# Altium project Fuel_Dispenser_Controller_V1.0.0.PrjPcb (part 1 of 2)
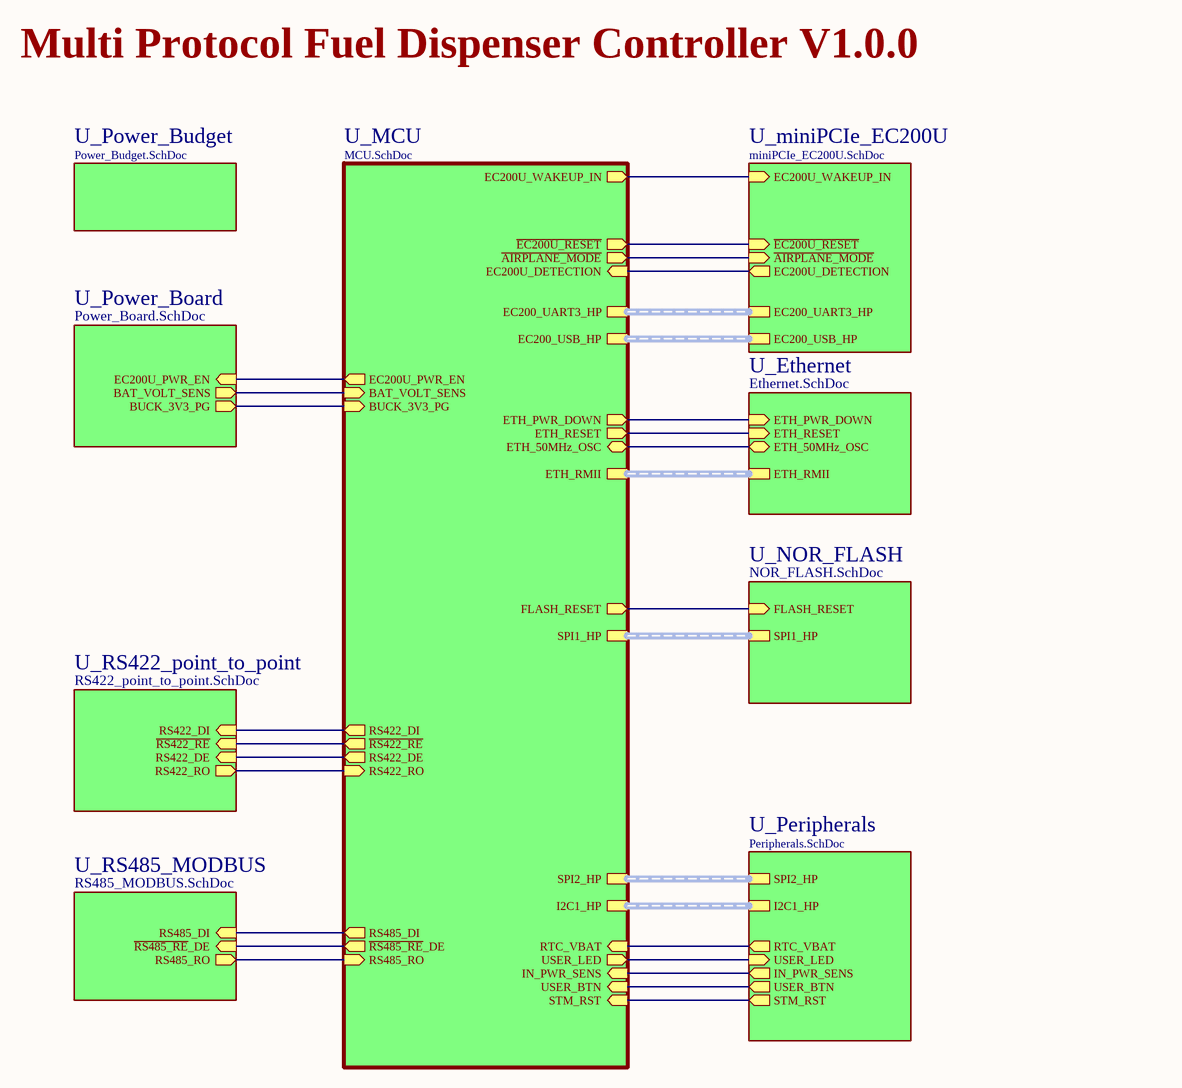
[diagram p0: Top_Sheet.SchDoc]
10 sheets, 253 parts. Net scope: hierarchical (ports join the sheet entries above them; power ports are global).
Board file: Fuel_Dispenser_Controller_V1.0.0.PcbDoc
Sheets:
  Top_Sheet.SchDoc
    U_MCU = MCU.SchDoc
    U_miniPCIe_EC200U = miniPCIe_EC200U.SchDoc
    U_Ethernet = Ethernet.SchDoc
    U_Power_Board = Power_Board.SchDoc
    U_RS485_MODBUS = RS485_MODBUS.SchDoc
    U_RS422_point_to_point = RS422_point_to_point.SchDoc
    U_NOR_FLASH = NOR_FLASH.SchDoc
    U_Peripherals = Peripherals.SchDoc
    U_Power_Budget = Power_Budget.SchDoc

## Sheet Top_Sheet.SchDoc
size A3; SheetNumber: 1; SheetTotal: 10

### Sub-sheets
U_Ethernet = Ethernet.SchDoc: ETH_RMII (harness ETH_RMII), ETH_50MHz_OSC (bidir), ETH_RESET (in), ETH_PWR_DOWN (in)
U_MCU = MCU.SchDoc: EC200U_WAKEUP_IN (out), ~{EC200U_RESET} (out), ~{AIRPLANE_MODE} (out), EC200U_DETECTION (in), SPI1_HP (harness SPI1), I2C1_HP (harness I2C1), EC200_USB_HP (harness EC200_USB), SPI2_HP (harness SPI2_uSD), EC200U_PWR_EN (out), STM_RST (in), RTC_VBAT (in), IN_PWR_SENS (in), USER_LED (out), USER_BTN (in), ETH_50MHz_OSC (bidir), ETH_RESET (out), EC200_UART3_HP (harness EC200_UART3), BAT_VOLT_SENS (in), ETH_RMII (harness ETH_RMII), RS485_RO (in), RS485_DI (out), ~{RS485_RE}_DE (out), RS422_RO (in), RS422_DI (out), ~{RS422_RE} (out), RS422_DE (out), BUCK_3V3_PG (in), FLASH_RESET (out), ETH_PWR_DOWN (out)
U_miniPCIe_EC200U = miniPCIe_EC200U.SchDoc: EC200_USB_HP (harness EC200_USB), EC200U_DETECTION (out), ~{AIRPLANE_MODE} (in), EC200_UART3_HP (harness EC200_UART3), ~{EC200U_RESET} (in), EC200U_WAKEUP_IN (in)
U_NOR_FLASH = NOR_FLASH.SchDoc: SPI1_HP (harness SPI1), FLASH_RESET (in)
U_Peripherals = Peripherals.SchDoc: I2C1_HP (harness I2C1), USER_LED (in), IN_PWR_SENS (out), USER_BTN (out), STM_RST (out), RTC_VBAT (out), SPI2_HP (harness SPI2_uSD)
U_Power_Board = Power_Board.SchDoc: BAT_VOLT_SENS (out), BUCK_3V3_PG (out), EC200U_PWR_EN (in)
U_Power_Budget = Power_Budget.SchDoc: no entries
U_RS422_point_to_point = RS422_point_to_point.SchDoc: RS422_DI (in), ~{RS422_RE} (in), RS422_DE (in), RS422_RO (out)
U_RS485_MODBUS = RS485_MODBUS.SchDoc: RS485_DI (in), ~{RS485_RE}_DE (in), RS485_RO (out)

### Nets
~{AIRPLANE_MODE}: sheet U_MCU/~{AIRPLANE_MODE}, sheet U_miniPCIe_EC200U/~{AIRPLANE_MODE}
BAT_VOLT_SENS: sheet U_MCU/BAT_VOLT_SENS, sheet U_Power_Board/BAT_VOLT_SENS
BUCK_3V3_PG: sheet U_MCU/BUCK_3V3_PG, sheet U_Power_Board/BUCK_3V3_PG
~{EC200U_RESET}: sheet U_MCU/~{EC200U_RESET}, sheet U_miniPCIe_EC200U/~{EC200U_RESET}
EC200U_DETECTION: sheet U_MCU/EC200U_DETECTION, sheet U_miniPCIe_EC200U/EC200U_DETECTION
EC200U_PWR_EN: sheet U_MCU/EC200U_PWR_EN, sheet U_Power_Board/EC200U_PWR_EN
EC200U_WAKEUP_IN: sheet U_MCU/EC200U_WAKEUP_IN, sheet U_miniPCIe_EC200U/EC200U_WAKEUP_IN
ETH_50MHz_OSC: sheet U_MCU/ETH_50MHz_OSC, sheet U_Ethernet/ETH_50MHz_OSC
ETH_PWR_DOWN: sheet U_MCU/ETH_PWR_DOWN, sheet U_Ethernet/ETH_PWR_DOWN
ETH_RESET: sheet U_MCU/ETH_RESET, sheet U_Ethernet/ETH_RESET
FLASH_RESET: sheet U_MCU/FLASH_RESET, sheet U_NOR_FLASH/FLASH_RESET
IN_PWR_SENS: sheet U_MCU/IN_PWR_SENS, sheet U_Peripherals/IN_PWR_SENS
~{RS485_RE}_DE: sheet U_MCU/~{RS485_RE}_DE, sheet U_RS485_MODBUS/~{RS485_RE}_DE
RS422_DE: sheet U_MCU/RS422_DE, sheet U_RS422_point_to_point/RS422_DE
RS422_DI: sheet U_MCU/RS422_DI, sheet U_RS422_point_to_point/RS422_DI
RS422_RE: sheet U_MCU/~{RS422_RE}, sheet U_RS422_point_to_point/~{RS422_RE}
RS422_RO: sheet U_MCU/RS422_RO, sheet U_RS422_point_to_point/RS422_RO
RS485_DI: sheet U_MCU/RS485_DI, sheet U_RS485_MODBUS/RS485_DI
RS485_RO: sheet U_MCU/RS485_RO, sheet U_RS485_MODBUS/RS485_RO
RTC_VBAT: sheet U_MCU/RTC_VBAT, sheet U_Peripherals/RTC_VBAT
STM_RST: sheet U_MCU/STM_RST, sheet U_Peripherals/STM_RST
USER_BTN: sheet U_MCU/USER_BTN, sheet U_Peripherals/USER_BTN
USER_LED: sheet U_MCU/USER_LED, sheet U_Peripherals/USER_LED

### Buses and harness runs
harness sheet U_Ethernet/ETH_RMII = sheet U_MCU/ETH_RMII
harness sheet U_MCU/EC200_UART3_HP = sheet U_miniPCIe_EC200U/EC200_UART3_HP
harness sheet U_MCU/EC200_USB_HP = sheet U_miniPCIe_EC200U/EC200_USB_HP
harness sheet U_MCU/I2C1_HP = sheet U_Peripherals/I2C1_HP
harness sheet U_MCU/SPI1_HP = sheet U_NOR_FLASH/SPI1_HP
harness sheet U_MCU/SPI2_HP = sheet U_Peripherals/SPI2_HP

### Notes on the sheet
- Multi Protocol Fuel Dispenser Controller V1.0.0

## Sheet MCU.SchDoc
size A2; SheetNumber: 2; SheetTotal: 10
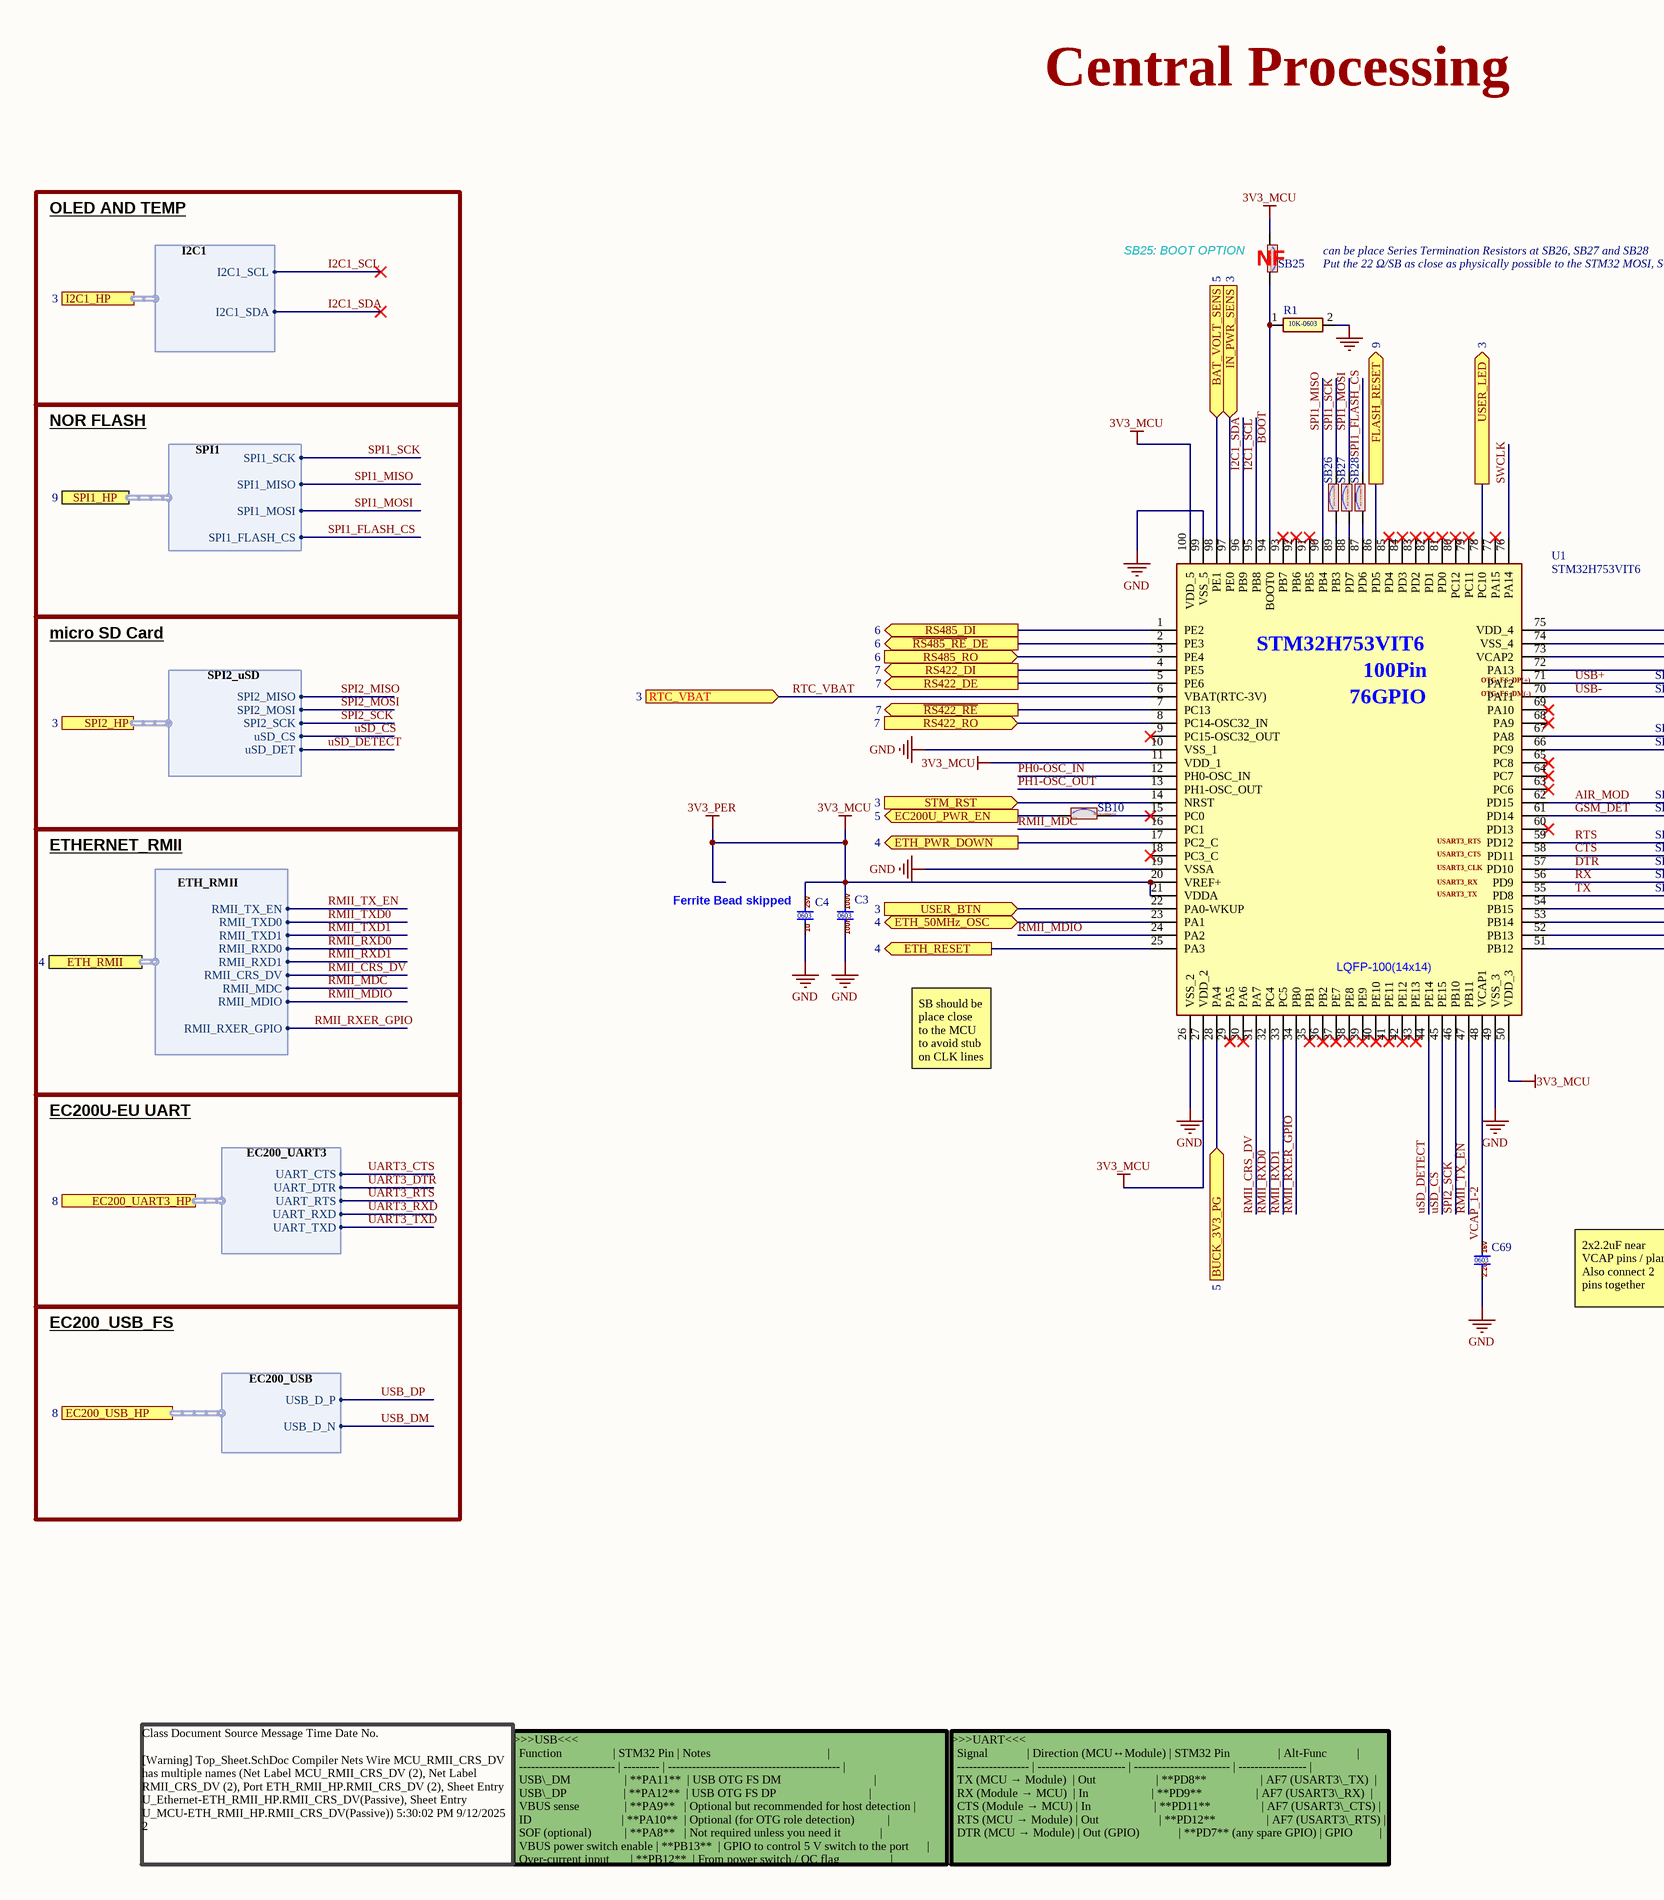
[diagram p1: MCU.SchDoc, left]
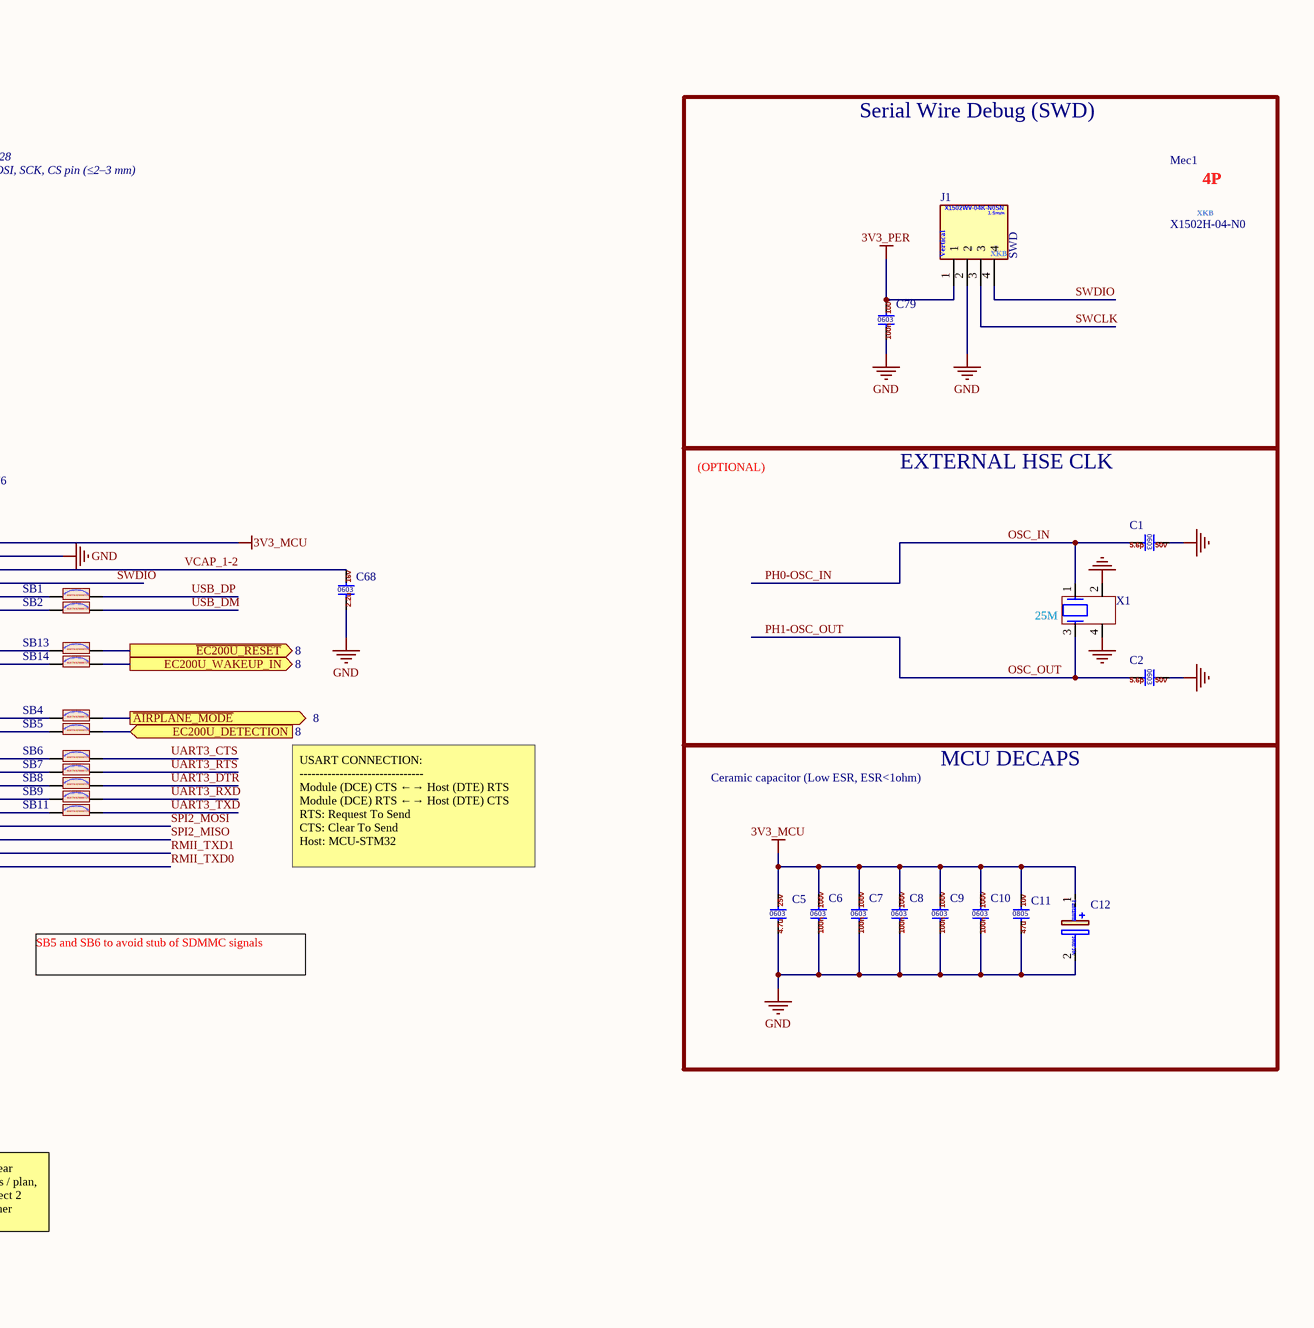
[diagram p2: MCU.SchDoc, right]

### Parts
C1  CL10C5R6CB8NNNC  [0603-CAP]  (value not drawn)
C2  CL10C5R6CB8NNNC  [0603-CAP]  (value not drawn)
C3  CL10B104KC8NNNC  [0603-CAP]  (value not drawn)
C4  CL10B105KA8NNNC  [0603-CAP]  (value not drawn)
C5  CL10A475KA8NQNC  [0603-CAP]  (value not drawn)
C6  CL10B104KC8NNNC  [0603-CAP]  (value not drawn)
C7  CL10B104KC8NNNC  [0603-CAP]  (value not drawn)
C8  CL10B104KC8NNNC  [0603-CAP]  (value not drawn)
C9  CL10B104KC8NNNC  [0603-CAP]  (value not drawn)
C10  CL10B104KC8NNNC  [0603-CAP]  (value not drawn)
C11  CL21A476MPYNNWE  [0805-CAP]  (value not drawn)
C12  TAJC107K010RNJ  [CASE-C-6032]  (value not drawn)
C68  CL10A225KO8NNNC  [0603-CAP]  (value not drawn)
C69  CL10A225KO8NNNC  [0603-CAP]  (value not drawn)
C79  CL10B104KC8NNNC  [0603-CAP]  (value not drawn)
J1  SWD  [JST 4P 1.5MM VERTICAL]
Mec1  X1502H-04-N0  (mechanical)
R1  0603WAF1002T5E  [0603-RES]  (value not drawn)
SB1  0603WAF0000T5E  [SOLDER-BRIDGE_R0603-0R]  (value not drawn)
SB2  0603WAF0000T5E  [SOLDER-BRIDGE_R0603-0R]  (value not drawn)
SB4  0603WAF0000T5E  [SOLDER-BRIDGE_R0603-0R]  (value not drawn)
SB5  0603WAF0000T5E  [SOLDER-BRIDGE_R0603-0R]  (value not drawn)
SB6  0603WAF0000T5E  [SOLDER-BRIDGE_R0603-0R]  (value not drawn)
SB7  0603WAF0000T5E  [SOLDER-BRIDGE_R0603-0R]  (value not drawn)
SB8  0603WAF0000T5E  [SOLDER-BRIDGE_R0603-0R]  (value not drawn)
SB9  0603WAF0000T5E  [SOLDER-BRIDGE_R0603-0R]  (value not drawn)
SB10  0603WAF0000T5E  [SOLDER-BRIDGE_R0603-0R]  (value not drawn)
SB11  0603WAF0000T5E  [SOLDER-BRIDGE_R0603-0R]  (value not drawn)
SB13  0603WAF0000T5E  [SOLDER-BRIDGE_R0603-0R]  (value not drawn)
SB14  0603WAF0000T5E  [SOLDER-BRIDGE_R0603-0R]  (value not drawn)
SB25  0603WAF0000T5E  [SOLDER-BRIDGE_R0603-0R]  (value not drawn)
SB26  0603WAF0000T5E  [SOLDER-BRIDGE_R0603-0R]  (value not drawn)
SB27  0603WAF0000T5E  [SOLDER-BRIDGE_R0603-0R]  (value not drawn)
SB28  0603WAF0000T5E  [SOLDER-BRIDGE_R0603-0R]  (value not drawn)
U1  STM32H753VIT6  [LQFP-100(14x14)]
X1  NX2016SA-25MHZ  [CRY_SMD2016-4P_NX2016SA]  (value not drawn)

### Blocks framed on the sheet
Serial Wire Debug (SWD): C79 J1 Mec1
EXTERNAL HSE CLK: C1 C2 X1
MCU DECAPS: C5-C12

### Ports
BAT_VOLT_SENS (in, see 5), BUCK_3V3_PG (in, see 5), EC200_UART3_HP (harness EC200_UART3, see 8), EC200_USB_HP (harness EC200_USB, see 8), EC200U_DETECTION (in, see 8), EC200U_PWR_EN (out, see 5), EC200U_WAKEUP_IN (out, see 8), ETH_50MHz_OSC (bidir, see 4), ETH_PWR_DOWN (out, see 4), ETH_RESET (out, see 4), ETH_RMII (harness ETH_RMII, see 4), FLASH_RESET (out, see 9), I2C1_HP (harness I2C1, see 3), IN_PWR_SENS (in, see 3), RS422_DE (out, see 7), RS422_DI (out, see 7), RS422_RO (in, see 7), RS485_DI (out, see 6), RS485_RO (in, see 6), RTC_VBAT (in, see 3), SPI1_HP (harness SPI1, see 9), SPI2_HP (harness SPI2_uSD, see 3), STM_RST (in, see 3), USER_BTN (in, see 3), USER_LED (out, see 3), ~{AIRPLANE_MODE} (out, see 8), ~{EC200U_RESET} (out, see 8), ~{RS422_RE} (out, see 7), ~{RS485_RE}_DE (out, see 6)

### Harnesses
SPI1: SPI1_SCK, SPI1_MISO, SPI1_MOSI, SPI1_FLASH_CS
I2C1: I2C1_SCL, I2C1_SDA
SPI2_uSD: uSD_CS, SPI2_MISO, SPI2_MOSI, SPI2_SCK, uSD_DET
EC200_UART3: UART_CTS, UART_DTR, UART_RTS, UART_RXD, UART_TXD
EC200_USB: USB_D_P, USB_D_N
ETH_RMII: RMII_TX_EN, RMII_TXD0, RMII_TXD1, RMII_RXD0, RMII_RXD1, RMII_CRS_DV, RMII_RXER_GPIO, RMII_MDC, RMII_MDIO

### Nets
3V3_MCU: C3.2 C4.2 C5.2 C6.2 C7.2 C8.2 C9.2 C10.2 C11.2 C12.1(+) C79.2 J1.1 SB25.1 U1.11(VDD_1) U1.20(VREF+) U1.21(VDDA) U1.27(VDD_2) U1.50(VDD_3) U1.75(VDD_4) U1.100(VDD_5)  [also labelled 3V3_PER]
GND: C1.2 C2.2 C3.1 C4.1 C5.1 C6.1 C7.1 C8.1 C9.1 C10.1 C11.1 C12.2(-) C68.1 C69.1 C79.1 J1.2 R1.2 U1.10(VSS_1) U1.19(VSSA) U1.26(VSS_2) U1.49(VSS_3) U1.74(VSS_4) U1.99(VSS_5) X1.2 X1.4
~{AIRPLANE_MODE}: SB4.2 ; port ~{AIRPLANE_MODE}
AIR_MOD: SB4.1 U1.62(PD15)  [project net AIR_MOD_2]
BAT_VOLT_SENS: U1.98(PE1) ; port BAT_VOLT_SENS
BOOT: R1.1 SB25.2 U1.94(BOOT0)  [project net BOOT_2]
BUCK_3V3_PG: U1.28(PA4) ; port BUCK_3V3_PG
CTS: SB7.1 U1.58(PD11)  [project net CTS_2]
DTR: SB8.1 U1.57(PD10)  [project net DTR_2]
~{EC200U_RESET}: SB13.2 ; port ~{EC200U_RESET}
EC200U_DETECTION: SB5.2 ; port EC200U_DETECTION
EC200U_PWR_EN: SB10.2 ; port EC200U_PWR_EN
EC200U_WAKEUP_IN: SB14.2 ; port EC200U_WAKEUP_IN
ETH_50MHz_OSC: U1.23(PA1) ; port ETH_50MHz_OSC
ETH_PWR_DOWN: U1.17(PC2_C) ; port ETH_PWR_DOWN
ETH_RESET: U1.25(PA3) ; port ETH_RESET
FLASH_RESET: U1.86(PD5) ; port FLASH_RESET
GSM_DET: SB5.1 U1.61(PD14)  [project net GSM_DET_2]
I2C1_SCL: U1.95(PB8) ; port I2C1_HP.I2C1_SCL
I2C1_SDA: U1.96(PB9) ; port I2C1_HP.I2C1_SDA
IN_PWR_SENS: U1.97(PE0) ; port IN_PWR_SENS
OSC_IN: C1.1 U1.12(PH0-OSC_IN) X1.1  [also labelled PH0-OSC_IN]  [project net OSC_IN_2]
OSC_OUT: C2.1 U1.13(PH1-OSC_OUT) X1.3  [also labelled PH1-OSC_OUT]  [project net OSC_OUT_2]
~{RS485_RE}_DE: U1.2(PE3) ; port ~{RS485_RE}_DE
RMII_CRS_DV: U1.31(PA7) ; port ETH_RMII.RMII_CRS_DV
RMII_MDC: U1.16(PC1) ; port ETH_RMII.RMII_MDC
RMII_MDIO: U1.24(PA2) ; port ETH_RMII.RMII_MDIO
RMII_RXD0: U1.32(PC4) ; port ETH_RMII.RMII_RXD0
RMII_RXD1: U1.33(PC5) ; port ETH_RMII.RMII_RXD1
RMII_RXER_GPIO: U1.34(PB0) ; port ETH_RMII.RMII_RXER_GPIO
RMII_TX_EN: U1.47(PB11) ; port ETH_RMII.RMII_TX_EN
RMII_TXD0: U1.51(PB12) ; port ETH_RMII.RMII_TXD0
RMII_TXD1: U1.52(PB13) ; port ETH_RMII.RMII_TXD1
RS422_DE: U1.5(PE6) ; port RS422_DE
RS422_DI: U1.4(PE5) ; port RS422_DI
RS422_RE: U1.7(PC13) ; port ~{RS422_RE}
RS422_RO: U1.8(PC14-OSC32_IN) ; port RS422_RO
RS485_DI: U1.1(PE2) ; port RS485_DI
RS485_RO: U1.3(PE4) ; port RS485_RO
RTC_VBAT: U1.6(VBAT(RTC-3V)) ; port RTC_VBAT
RTS: SB6.1 U1.59(PD12)  [project net RTS_2]
RX: SB9.1 U1.56(PD9)  [project net RX_2]
SPI1_FLASH_CS: SB28.2 ; port SPI1_HP.SPI1_FLASH_CS
SPI1_MISO: U1.90(PB4) ; port SPI1_HP.SPI1_MISO
SPI1_MOSI: SB27.2 ; port SPI1_HP.SPI1_MOSI
SPI1_SCK: SB26.2 ; port SPI1_HP.SPI1_SCK
SPI2_MISO: U1.53(PB14) ; port SPI2_HP.SPI2_MISO
SPI2_MOSI: U1.54(PB15) ; port SPI2_HP.SPI2_MOSI
SPI2_SCK: U1.46(PB10) ; port SPI2_HP.SPI2_SCK
STM_RST: U1.14(NRST) ; port STM_RST
SWCLK: J1.3 U1.76(PA14)  [project net SWCLK_2]
SWDIO: J1.4 U1.72(PA13)  [project net SWDIO_2]
TX: SB11.1 U1.55(PD8)  [project net TX_2]
UART3_CTS: SB6.2 ; port EC200_UART3_HP.UART_CTS
UART3_DTR: SB8.2 ; port EC200_UART3_HP.UART_DTR
UART3_RTS: SB7.2 ; port EC200_UART3_HP.UART_RTS
UART3_RXD: SB9.2 ; port EC200_UART3_HP.UART_RXD
UART3_TXD: SB11.2 ; port EC200_UART3_HP.UART_TXD
USB+: SB1.1 U1.71(PA12)  [project net USB+_2]
USB-: SB2.1 U1.70(PA11)  [project net USB-_2]
USB_DM: SB2.2 ; port EC200_USB_HP.USB_D_N  [project net USB_D_N]
USB_DP: SB1.2 ; port EC200_USB_HP.USB_D_P  [project net USB_D_P]
uSD_CS: U1.45(PE15) ; port SPI2_HP.uSD_CS
uSD_DETECT: U1.44(PE14) ; port SPI2_HP.uSD_DET
USER_BTN: U1.22(PA0-WKUP) ; port USER_BTN
USER_LED: U1.78(PC10) ; port USER_LED
VCAP_1-2: C68.2 C69.2 U1.48(VCAP1) U1.73(VCAP2)  [project net VCAP_1-2_2]
NetSB10_1: SB10.1 U1.15(PC0)
NetSB13_1: SB13.1 U1.67(PA8)
NetSB14_1: SB14.1 U1.66(PC9)
NetSB26_1: SB26.1 U1.89(PB3)
NetSB27_1: SB27.1 U1.88(PD7)
NetSB28_1: SB28.1 U1.87(PD6)

Not connected (* = marked no-connect by the designer): U1 9(PC15-OSC32_OUT)* 18(PC3_C)* 29(PA5)* 30(PA6)* 35(PB1)* 36(PB2)* 37(PE7)* 38(PE8)* 39(PE9)* 40(PE10)* 41(PE11)* 42(PE12)* 43(PE13)* 60(PD13)* 63(PC6)* 64(PC7)* 65(PC8)* 68(PA9)* 69(PA10)* 77(PA15)* 79(PC11)* 80(PC12)* 81(PD0)* 82(PD1)* 83(PD2)* 84(PD3)* 85(PD4)* 91(PB5)* 92(PB6)* 93(PB7)*

### Notes on the sheet
- Central Processing
- OLED AND TEMP
- (near SB25) SB25: BOOT OPTION
- (near SB25) NF
- can be place Series Termination Resistors at SB26, SB27 and SB28
- Put the 22 Ω/SB as close as physically possible to the STM32 MOSI, SCK, CS pin (≤2–3 mm)
- NOR FLASH
- (OPTIONAL)
- micro SD Card
- (near U1) OTG_FS_DP(+)
- (near U1) OTG_FS_DM(-)
- (near X1) 25M
- ETHERNET_RMII
- (near U1) USART3_RX
- (near U1) USART3_CLK
- (near U1) USART3_CTS
- (near U1) USART3_RTS
- Ceramic capacitor (Low ESR, ESR<1ohm)
- (near C4) Ferrite Bead skipped
- (near U1) USART3_TX
- USART CONNECTION:
  -------------------------------
  Module (DCE) CTS ←→ Host (DTE) RTS
  Module (DCE) RTS ←→ Host (DTE) CTS
  RTS: Request To Send
  CTS: Clear To Send
  Host: MCU-STM32
- SB should be place close to the MCU to avoid stub on CLK lines
- SB5 and SB6 to avoid stub of SDMMC signals
- EC200U-EU UART
- EC200_USB_FS
- 2x2.2uF near VCAP pins / plan,
  Also connect 2 pins together
- Class	Document	Source	Message	Time	Date	No.
  [Warning]	Top_Sheet.SchDoc	Compiler	Nets Wire MCU_RMII_CRS_DV has multiple names (Net Label MCU_RMII_CRS_DV (2), Net Label RMII_CRS_DV (2), Port ETH_RMII_HP.RMII_CRS_DV (2), Sheet Entry U_Ethernet-ETH_RMII_HP.RMII_CRS_DV(Passive), Sheet Entry U_MCU-ETH_RMII_HP.RMII_CRS_DV(Passive))	5:30:02 PM	9/12/2025	2
- >>>USB<<<
  | Function                 | STM32 Pin | Notes                                       |
  | ------------------------ | --------- | ------------------------------------------- |
  | USB\_DM                  | **PA11**  | USB OTG FS DM                               |
  | USB\_DP                   | **PA12**  | USB OTG FS DP                               |
  | VBUS sense               | **PA9**   | Optional but recommended for host detection |
  | ID                              | **PA10**  | Optional (for OTG role detection)           |
  | SOF (optional)           | **PA8**   | Not required unless you need it             |
  | VBUS power switch enable | **PB13**  | GPIO to control 5 V switch to the port      |
  | Over-current input       | **PB12**  | From power switch / OC flag                 |
- >>>UART<<<
  | Signal             | Direction (MCU↔Module) | STM32 Pin                | Alt-Func          |
  | ------------------ | ---------------------- | ------------------------ | ----------------- |
  | TX (MCU → Module)  | Out                    | **PD8**                  | AF7 (USART3\_TX)  |
  | RX (Module → MCU)  | In                     | **PD9**                  | AF7 (USART3\_RX)  |
  | CTS (Module → MCU) | In                     | **PD11**                 | AF7 (USART3\_CTS) |
  | RTS (MCU → Module) | Out                    | **PD12**                 | AF7 (USART3\_RTS) |
  | DTR (MCU → Module) | Out (GPIO)             | **PD7** (any spare GPIO) | GPIO         |
- (in symbol 0603WAF1002T5E) 10K-0603
- (in symbol CL10A225KO8NNNC) 16v; 0603; 2.2u
- (in symbol CL10A475KA8NQNC) 25v; 0603; 4.7u
- (in symbol CL10B104KC8NNNC) 100v; 0603; 100n
- (in symbol CL10B105KA8NNNC) 25v; 0603; 1u
- (in symbol CL10C5R6CB8NNNC) 0603; 5.6p; 50v
- (in symbol CL21A476MPYNNWE) 10v; 0805; 47u
- (in symbol STM32H753VIT6) 100Pin; 76GPIO; LQFP-100(14x14)
- (in symbol TAJC107K010RNJ) Tantalum; 100u/10v
- (in symbol X1502H-04-N0) 4P; XKB
- (in symbol X1502WV-04K-N0SN) 1.5mm; Vertical; XKB

### Library data of the parts
C1 C2 = CL10C5R6CB8NNNC: CAP: CER 5.6PF 50V C0G 0603; LCSC Part #: C318670; Unit Price: 0.0037; ComponentLink1Description: DS; ComponentLink1URL: https://www.lcsc.com/datasheet/C1663.pdf
C3 C6-C10 C79 = CL10B104KC8NNNC: CAP: CER 100NF 100V X7R 0603; POC Price: 0.006; LCSC Part #: C15725; Unit Price: 0.0036; ComponentLink1Description: DS; ComponentLink1URL: https://www.lcsc.com/datasheet/C15725.pdf
C4 = CL10B105KA8NNNC: CAP: CER 1UF 25V X7R 0603; LCSC Part #: C29936; Unit Price: 0.0027; ComponentLink1Description: DS; ComponentLink1URL: https://www.lcsc.com/datasheet/C29936.pdf
C5 = CL10A475KA8NQNC: CAP: CER 4.7UF 25V X5R 0603; POC Price: 0.0167; LCSC Part #: C69335; Unit Price: 0.009; ComponentLink1Description: DS; ComponentLink1URL: https://www.lcsc.com/datasheet/C69335.pdf
C11 = CL21A476MPYNNWE: CAP: CER 47UF 10V X5R 0805; POC Price: 0.1234; LCSC Part #: C5596752; Unit Price: 0.0651; ComponentLink1Description: DS; ComponentLink1URL: https://www.lcsc.com/datasheet/C5596752.pdf
C12 = TAJC107K010RNJ: CAP: TANT 100uF ±10% 10V CASE-C-6032; POC Price: 0.2633; LCSC Part #: C8649; Unit Price: 0.1376; ComponentLink1Description: DS; ComponentLink1URL: http://datasheets.avx.com/TAJ.pdf
C68 C69 = CL10A225KO8NNNC: CAP: CER 2.2UF 16V X5R 0603; POC Price: 0.0062; LCSC Part #: C23630; Unit Price: 0.0033; ComponentLink1Description: DS; ComponentLink1URL: https://www.lcsc.com/datasheet/C23630.pdf
J1 = X1502WV-04K-N0SN: JST: Vertical, P1.5mm TH, 4P, Wire To Board Connector, 1A (Housing: X1502H-04-N0 - C697055); POC Price: 0.0307; LCSC Part #: C561527; Unit Price: 0.0141; ComponentLink1Description: DS; ComponentLink1URL: https://www.lcsc.com/datasheet/C561527.pdf
Mec1 = X1502H-04-N0: JST Housing: P1.5mm, 4P, Wire To Board; POC Price: 0.0139; LCSC Part #: C697055; Unit Price: 0.0063; ComponentLink1Description: DS; ComponentLink1URL: https://www.lcsc.com/datasheet/C697055.pdf
R1 = 0603WAF1002T5E: RES: 10K OHM 1% 100mW 0603 75V; LCSC Part #: C25804; Unit Price: 0.0005; ComponentLink1Description: DS; ComponentLink1URL: https://www.lcsc.com/datasheet/C25804.pdf
SB1 SB2 SB4-SB11 SB13 SB14 SB25-SB28 = 0603WAF0000T5E: Solder Bridge: ON SB 0603; LCSC Part #: C21189; Unit Price: 0.0006; ComponentLink1Description: DS; ComponentLink1URL: https://www.lcsc.com/datasheet/C21189.pdf
U1 = STM32H753VIT6: MCU: 32-bit Arm Cortex-M7 480MHz MCUs, 2MB Flash, 1MB RAM, 46 com. and analog interfaces, crypto, LQFP-100(14x14); POC Price: 11.0179; LCSC Part #: C730206; Unit Price: 7.6492; ComponentLink1Description: DS; ComponentLink1URL: https://www.st.com/resource/en/datasheet/stm32h753vi.pdf
X1 = NX2016SA-25MHZ: CRYSTAL: SMD2016-4P Crystals ROHS 25MHz; POC Price: 0.3434; LCSC Part #: C843258; Unit Price: 0.1723; ComponentLink1Description: DS; ComponentLink1URL: https://www.lcsc.com/datasheet/C843258.pdf

## Sheet miniPCIe_EC200U.SchDoc
size A3; SheetNumber: 8; SheetTotal: 10
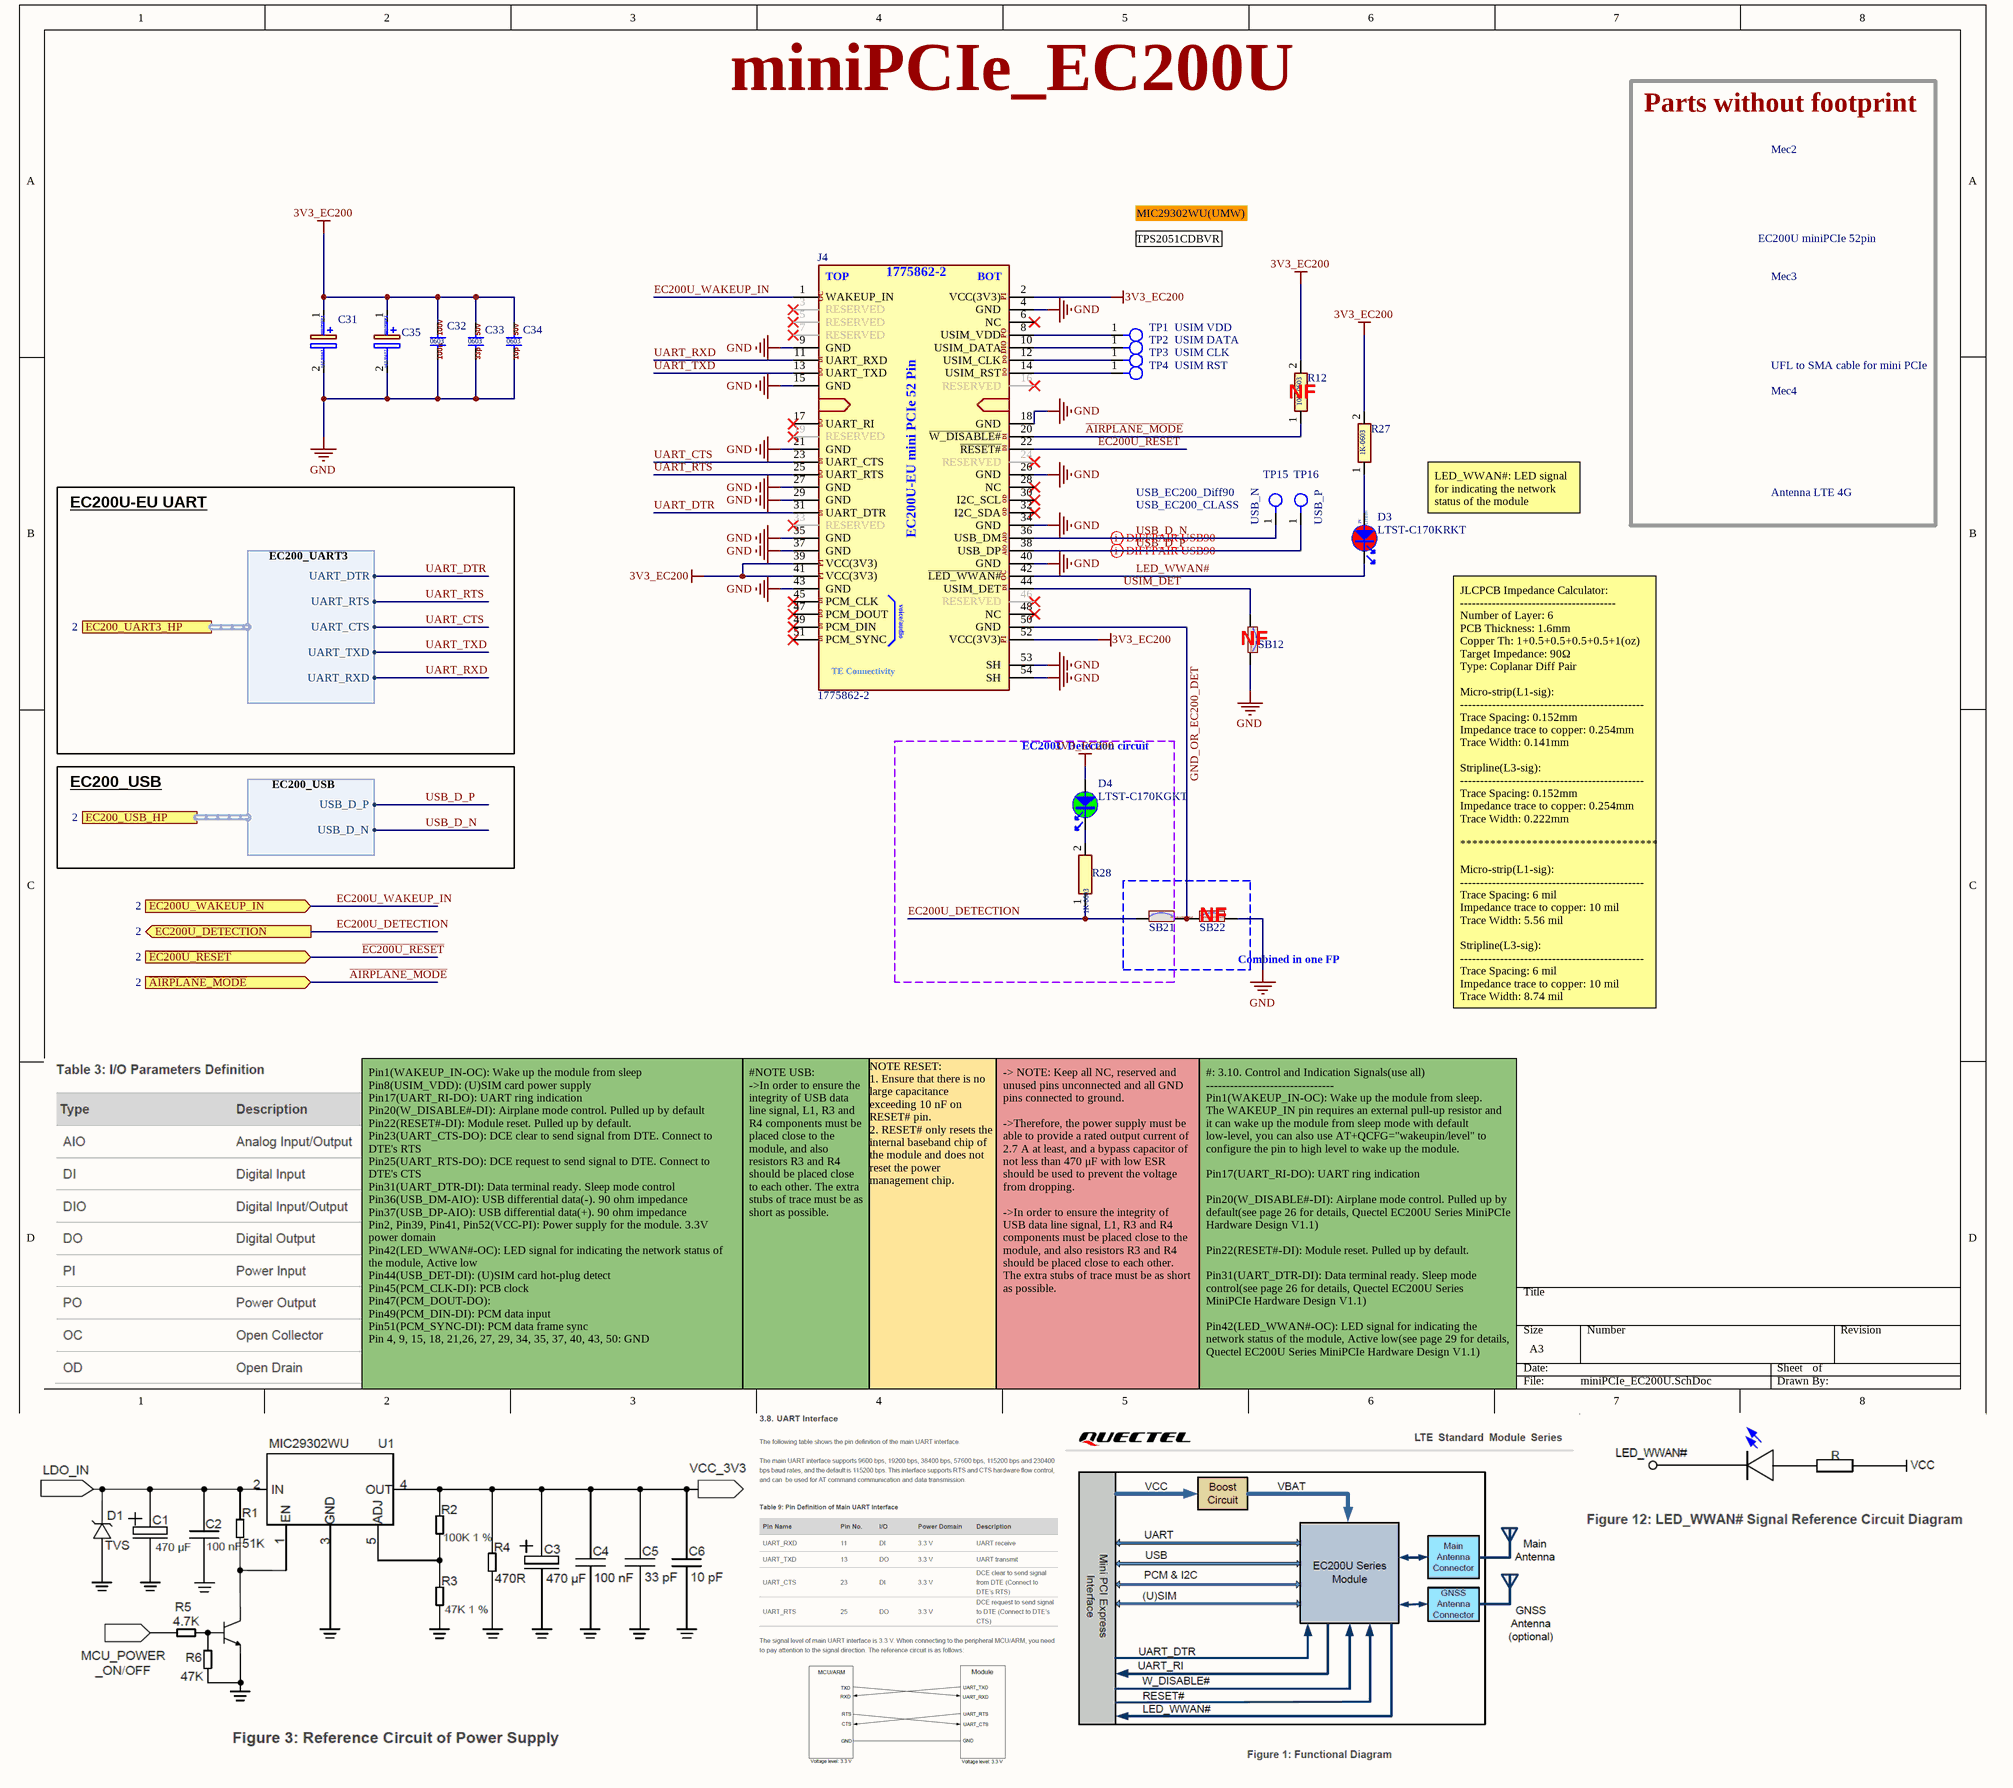
[diagram p3: miniPCIe_EC200U.SchDoc]

### Parts
C31  TAJC107K010RNJ  [CASE-C-6032]  (value not drawn)
C32  CL10B104KC8NNNC  [0603-CAP]  (value not drawn)
C33  CL10C330JB8NNNC  [0603-CAP]  (value not drawn)
C34  CL10C100JB8NNNC  [0603-CAP]  (value not drawn)
C35  TAJD227K010RNJ  [CASE-D-7343]  (value not drawn)
D3  LTST-C170KRKT  [0805-LED-RED]
D4  LTST-C170KGKT  [0805-LED-BLUE]
J4  1775862-2  [mini PCIe 52p 67910-5700]
Mec2  EC200U miniPCIe 52pin  [mini PCIe 52pin Module]  (mechanical)
Mec3  UFL to SMA cable for mini PCIe  (mechanical)
Mec4  Antenna LTE 4G  (mechanical)
R12  0603WAF1002T5E  [0603-RES]  (value not drawn)
R27  0603WAF1001T5E  [0603-RES]  (value not drawn)
R28  0603WAF1001T5E  [0603-RES]  (value not drawn)
SB12  0603WAF0000T5E  [SOLDER-BRIDGE_R0603-0R]  (value not drawn)
SB21  0603WAF0000T5E  [SOLDER-BRIDGE_R0603-0R]  (value not drawn)
SB22  0603WAF0000T5E  [SOLDER-BRIDGE_R0603-0R]  (value not drawn)
TP1  USIM VDD  [Test Pad FP]
TP2  USIM DATA  [Test Pad FP]
TP3  USIM CLK  [Test Pad FP]
TP4  USIM RST  [Test Pad FP]
TP15  USB_N  [Test Pad FP]
TP16  USB_P  [Test Pad FP]

### Blocks framed on the sheet
Parts without footprint: Mec2-Mec4
EC200U Detection circuit: D4 R28
NF: SB21 SB22

### Ports
EC200_UART3_HP (harness EC200_UART3, see 2), EC200_USB_HP (harness EC200_USB, see 2), EC200U_DETECTION (out, see 2), EC200U_WAKEUP_IN (in, see 2), ~{AIRPLANE_MODE} (in, see 2), ~{EC200U_RESET} (in, see 2)

### Harnesses
EC200_UART3: UART_DTR, UART_RTS, UART_CTS, UART_TXD, UART_RXD
EC200_USB: USB_D_P, USB_D_N

### Nets
3V3_EC200: C31.1(+) C32.2 C33.2 C34.2 C35.1(+) D4.1 J4.2(VCC(3V3)) J4.39(VCC(3V3)) J4.41(VCC(3V3)) J4.52(VCC(3V3)) R12.2 R27.2
GND: C31.2(-) C32.1 C33.1 C34.1 C35.2(-) J4.4(GND) J4.9(GND) J4.15(GND) J4.18(GND) J4.21(GND) J4.26(GND) J4.27(GND) J4.29(GND) J4.34(GND) J4.35(GND) J4.37(GND) J4.40(GND) J4.43(GND) J4.53(SH) J4.54(SH) SB12.2 SB22.2
~{AIRPLANE_MODE}: J4.20(~{W_DISABLE#}) R12.1 ; port ~{AIRPLANE_MODE}
~{EC200U_RESET}: J4.22(~{RESET#}) ; port ~{EC200U_RESET}
EC200U_DETECTION: R28.1 SB21.2 ; port EC200U_DETECTION
EC200U_WAKEUP_IN: J4.1(WAKEUP_IN) ; port EC200U_WAKEUP_IN
GND_OR_EC200_DET: J4.50(GND) SB21.1 SB22.1  [project net GND_OR_EC200_DET_8]
LED_WWAN#: D3.2 J4.42(~{LED_WWAN#})  [project net LED_WWAN#_8]
UART_CTS: J4.23(UART_CTS) ; port EC200_UART3_HP.UART_CTS  [project net UART3_CTS]
UART_DTR: J4.31(UART_DTR) ; port EC200_UART3_HP.UART_DTR  [project net UART3_DTR]
UART_RTS: J4.25(UART_RTS) ; port EC200_UART3_HP.UART_RTS  [project net UART3_RTS]
UART_RXD: J4.11(UART_RXD) ; port EC200_UART3_HP.UART_RXD  [project net UART3_RXD]
UART_TXD: J4.13(UART_TXD) ; port EC200_UART3_HP.UART_TXD  [project net UART3_TXD]
USB_D_N: J4.36(USB_DM) TP15.1 ; port EC200_USB_HP.USB_D_N
USB_D_P: J4.38(USB_DP) TP16.1 ; port EC200_USB_HP.USB_D_P
USIM_DET: J4.44(USIM_DET) SB12.1  [project net USIM_DET_8]
NetD3_1: D3.1 R27.1
NetD4_2: D4.2 R28.2
NetJ4_8: J4.8(USIM_VDD) TP1.1
NetJ4_10: J4.10(USIM_DATA) TP2.1
NetJ4_12: J4.12(USIM_CLK) TP3.1
NetJ4_14: J4.14(USIM_RST) TP4.1

Not connected (* = marked no-connect by the designer): J4 3(RESERVED)* 5(RESERVED)* 6(NC)* 7(RESERVED)* 16(RESERVED)* 17(UART_RI)* 19(RESERVED)* 24(RESERVED)* 28(NC)* 30(I2C_SCL)* 32(I2C_SDA)* 33(RESERVED)* 45(PCM_CLK)* 46(RESERVED)* 47(PCM_DOUT)* 48(NC)* 49(PCM_DIN)* 51(PCM_SYNC)*

### Layout directives
differential pair; differential pair class USB_EC200_Diff90; net class USB_EC200_CLASS: USB_D_N, USB_D_P

### Notes on the sheet
- miniPCIe_EC200U
- MIC29302WU(UMW)
- TPS2051CDBVR
- (near R12) NF
- EC200U-EU UART
- LED_WWAN#: LED signal for indicating the network status of the module
- (near SB12) NF
- EC200_USB
- Combined in one FP
- JLCPCB Impedance Calculator:
  ---------------------------------------
  Number of Layer: 6
  PCB Thickness: 1.6mm
  Copper Th: 1+0.5+0.5+0.5+0.5+1(oz)
  Target Impedance: 90Ω
  Type: Coplanar Diff Pair
  Micro-strip(L1-sig):
  ----------------------------------------------
  Trace Spacing: 0.152mm
  Impedance trace to copper: 0.254mm
  Trace Width: 0.141mm
  Stripline(L3-sig):
  ----------------------------------------------
  Trace Spacing: 0.152mm
  Impedance trace to copper: 0.254mm
  Trace Width: 0.222mm
  *********************************
  Micro-strip(L1-sig):
  ----------------------------------------------
  Trace Spacing: 6 mil
  Impedance trace to copper: 10 mil
  Trace Width: 5.56 mil
  Stripline(L3-sig):
  ----------------------------------------------
  Trace Spacing: 6 mil
  Impedance trace to copper: 10 mil
  Trace Width: 8.74 mil
- Pin1(WAKEUP_IN-OC): Wake up the module from sleep
  Pin8(USIM_VDD): (U)SIM card power supply
  Pin17(UART_RI-DO): UART ring indication
  Pin20(W_DISABLE#-DI): Airplane mode control. Pulled up by default
  Pin22(RESET#-DI): Module reset. Pulled up by default.
  Pin23(UART_CTS-DO): DCE clear to send signal from DTE. Connect to DTE's RTS
  Pin25(UART_RTS-DO): DCE request to send signal to DTE. Connect to DTE's CTS
  Pin31(UART_DTR-DI): Data terminal ready. Sleep mode control
  Pin36(USB_DM-AIO): USB differential data(-). 90 ohm impedance
  Pin37(USB_DP-AIO): USB differential data(+). 90 ohm impedance
  Pin2, Pin39, Pin41, Pin52(VCC-PI): Power supply for the module. 3.3V power domain
  Pin42(LED_WWAN#-OC): LED signal for indicating the network status of the module, Active low
  Pin44(USB_DET-DI): (U)SIM card hot-plug detect
  Pin45(PCM_CLK-DI): PCB clock
  Pin47(PCM_DOUT-DO):
  Pin49(PCM_DIN-DI): PCM data input
  Pin51(PCM_SYNC-DI): PCM data frame sync
  Pin 4, 9, 15, 18, 21,26, 27, 29, 34, 35, 37, 40, 43, 50: GND
- #NOTE USB:
  ->In order to ensure the integrity of USB data line signal, L1, R3 and R4 components must be placed close to the module, and also resistors R3 and R4 should be placed close to each other. The extra stubs of trace must be as short as possible.
- NOTE RESET:
  1. Ensure that there is no large capacitance exceeding 10 nF on RESET# pin.
  2. RESET# only resets the internal baseband chip of the module and does not reset the power
  management chip.
- -> NOTE: Keep all NC, reserved and unused pins unconnected and all GND pins connected to ground.
  ->Therefore, the power supply must be able to provide a rated output current of 2.7 A at least, and a bypass capacitor of not less than 470 μF with low ESR should be used to prevent the voltage from dropping.
  ->In order to ensure the integrity of USB data line signal, L1, R3 and R4 components must be placed close to the module, and also resistors R3 and R4 should be placed close to each other. The extra stubs of trace must be as short as possible.
- #: 3.10. Control and Indication Signals(use all)
  --------------------------------
  Pin1(WAKEUP_IN-OC): Wake up the module from sleep.
  The WAKEUP_IN pin requires an external pull-up resistor and it can wake up the module from sleep mode with default low-level, you can also use AT+QCFG="wakeupin/level" to configure the pin to high level to wake up the module.
  Pin17(UART_RI-DO): UART ring indication
  Pin20(W_DISABLE#-DI): Airplane mode control. Pulled up by default(see page 26 for details, Quectel EC200U Series MiniPCIe Hardware Design V1.1)
  Pin22(RESET#-DI): Module reset. Pulled up by default.
  Pin31(UART_DTR-DI): Data terminal ready. Sleep mode control(see page 26 for details, Quectel EC200U Series MiniPCIe Hardware Design V1.1)
  Pin42(LED_WWAN#-OC): LED signal for indicating the network status of the module, Active low(see page 29 for details, Quectel EC200U Series MiniPCIe Hardware Design V1.1)
- (in symbol 0603WAF1001T5E) 1K-0603
- (in symbol 0603WAF1002T5E) 10K-0603
- (in symbol 1775862-2) TOP; BOT; OC; PI; PO; DIO; DI; DO; OD; EC200U-EU mini PCIe 52 Pin; AIO; voice/audio; TE Connectivity
- (in symbol CL10B104KC8NNNC) 100v; 0603; 100n
- (in symbol CL10C100JB8NNNC) 50v; 0603; 10p
- (in symbol CL10C330JB8NNNC) 50v; 0603; 33p
- (in symbol LTST-C170KGKT) LITEON; 2V
- (in symbol LTST-C170KRKT) 2V; LITEON
- (in symbol TAJC107K010RNJ) Tantalum; 100u/10v
- (in symbol TAJD227K010RNJ) Tantalum; 220u/10v

### Library data of the parts
C31 = TAJC107K010RNJ: as C12 on sheet MCU; LCSC Part #: C8649; Unit Price: 0.1376; ComponentLink1Description: DS; ComponentLink1URL: http://datasheets.avx.com/TAJ.pdf
C32 = CL10B104KC8NNNC: as C3 on sheet MCU; LCSC Part #: C15725; Unit Price: 0.0036; ComponentLink1Description: DS; ComponentLink1URL: https://www.lcsc.com/datasheet/C15725.pdf
C33 = CL10C330JB8NNNC: CAP: CER 33PF 50V C0G 0603; LCSC Part #: C1663; Unit Price: 0.0031; ComponentLink1Description: DS; ComponentLink1URL: https://www.lcsc.com/datasheet/C1663.pdf
C34 = CL10C100JB8NNNC: CAP: CER 10PF 50V C0G 0603; LCSC Part #: C1634; Unit Price: 0.0028; ComponentLink1Description: DS; ComponentLink1URL: https://www.lcsc.com/datasheet/C1634.pdf
C35 = TAJD227K010RNJ: CAP: TANT 220uF ±10% 10V CASE-D-7343; POC Price: 0.3941; LCSC Part #: C8024; Unit Price: 0.2118
D3 = LTST-C170KRKT: LED: RED 20mA 54mcd Colorless Transparent Lens -55℃~+85℃ 631nm Red 130° 75mW 2V 0805 LED; POC Price: 0.0229; LCSC Part #: C94868; Unit Price: 0.0107
D4 = LTST-C170KGKT: LED: GREEN 20mA 35mcd Water Clear -55℃~+85℃ 571nm Yellow Green 130° 75mW 2V 0805 LED Indication - Discrete ROHS; POC Price: 0.0216; LCSC Part #: C98221; Unit Price: 0.0095; ComponentLink1Description: DS; ComponentLink1URL: https://www.lcsc.com/datasheet/C98221.pdf
J4 = 1775862-2: MODULE Connector: Mini PCIe 52-pin Connector SMD,P=0.8mm, Surface Mount,Right Angle PCI / PCIe Connector ROHS; POC Price: 0.7298; LCSC Part #: C428486; ComponentLink1Description: DS; ComponentLink1URL: https://www.molex.com/content/dam/molex/molex-dot-com/products/automated/en-us/salesdrawingpdf/679/67910/679105700_sd.pdf?inline; Unit Price: 0.3649
Mec2 = EC200U miniPCIe 52pin: MODULE: Quectel EC200U miniPCIe 52pin 4G LTE GSM, PCIe,; POC Price: 15; LCSC Part #: https://www.alibaba.com/product-detail/Brand-New-and-Original-Quectel-EC200U_1601064789596.html?spm=a2700.prosearch.normal_offer.d_title.422b67afllIdzs&priceId=50a60fb9066940529a1ec6d8fa9d6de6; Unit Price: 10; ComponentLink1Description: DS; ComponentLink1URL: https://www.quectel.com/download/quectel_ec200u_series_mini_pcie_hardware_design_v1-1/
Mec3 = UFL to SMA: Antenna: UFL to SMA cable for mini PCIe; POC Price: 1; ComponentLink1Description: DS; ComponentLink1URL: https://www.robotechbd.com/product/wireless-communication/wi-fi/ipx-antenna-adapter-wire-for-wifi-gsm-gps-1-13mm/?srsltid=AfmBOorCMt7rqkyjPz3-0c_fwJbcSa-rEp0Q6wX8ybJDhvlJA9ge8PRj; LCSC Part #: https://www.robotechbd.com/product/wireless-communication/wi-fi/ipx-antenna-adapter-wire-for-wifi-gsm-gps-1-13mm/?srsltid=AfmBOorCMt7rqkyjPz3-0c_fwJbcSa-rEp0Q6wX8ybJDhvlJA9ge8PRj; Unit Price: 0.4; ComponentLink2Description: Purchase; ComponentLink2URL: https://www.robotechbd.com/product/wireless-communication/wi-fi/ipx-antenna-adapter-wire-for-wifi-gsm-gps-1-13mm/?srsltid=AfmBOorCMt7rqkyjPz3-0c_fwJbcSa-rEp0Q6wX8ybJDhvlJA9ge8PRj
Mec4 = Antenna LTE 4G: Antenna: LTE 4G 4G LTE Sucker Antenna Full Netcom High Gain Communication Antenna IoT Router Terminal Sucker Antenna; POC Price: 0.4; ComponentLink1Description: Purchase Link; ComponentLink1URL: *
R12 = 0603WAF1002T5E: RES: 10K OHM 1% 100mW 0603 75V; LCSC Part #: C25804; Unit Price: 0.0005; ComponentLink1Description: DS; ComponentLink1URL: https://www.lcsc.com/datasheet/C25804.pdf
R27 R28 = 0603WAF1001T5E: RES: 1K OHM 1% 100mW 0603 75V; LCSC Part #: C21190; Unit Price: 0.0005; ComponentLink1Description: DS; ComponentLink1URL: https://www.lcsc.com/datasheet/C21190.pdf
SB12 SB21 SB22 = 0603WAF0000T5E: Solder Bridge: ON SB 0603; LCSC Part #: C21189; Unit Price: 0.0006; ComponentLink1Description: DS; ComponentLink1URL: https://www.lcsc.com/datasheet/C21189.pdf
TP1-TP4 TP15 TP16 = Test Pad: TESTPAD: Test Pad

## Sheet Ethernet.SchDoc: Ethernet PHY with RJ45 connector
size A3; Date: Not used; ApprovedBy: Not used; CheckedBy: Not used; Author: Not used; CompanyName: STMicroelectronics; DrawnBy: Not used; Engineer: Not used; Organization: Not used; Address1: Not used; Address2: Not used; Address3: Not used; Address4: Not used; DocumentNumber: 6; Revision: Not used; SheetNumber: 4; SheetTotal: 10; Time: Not used; ImagePath: Not used; Application_BuildNumber: Not used
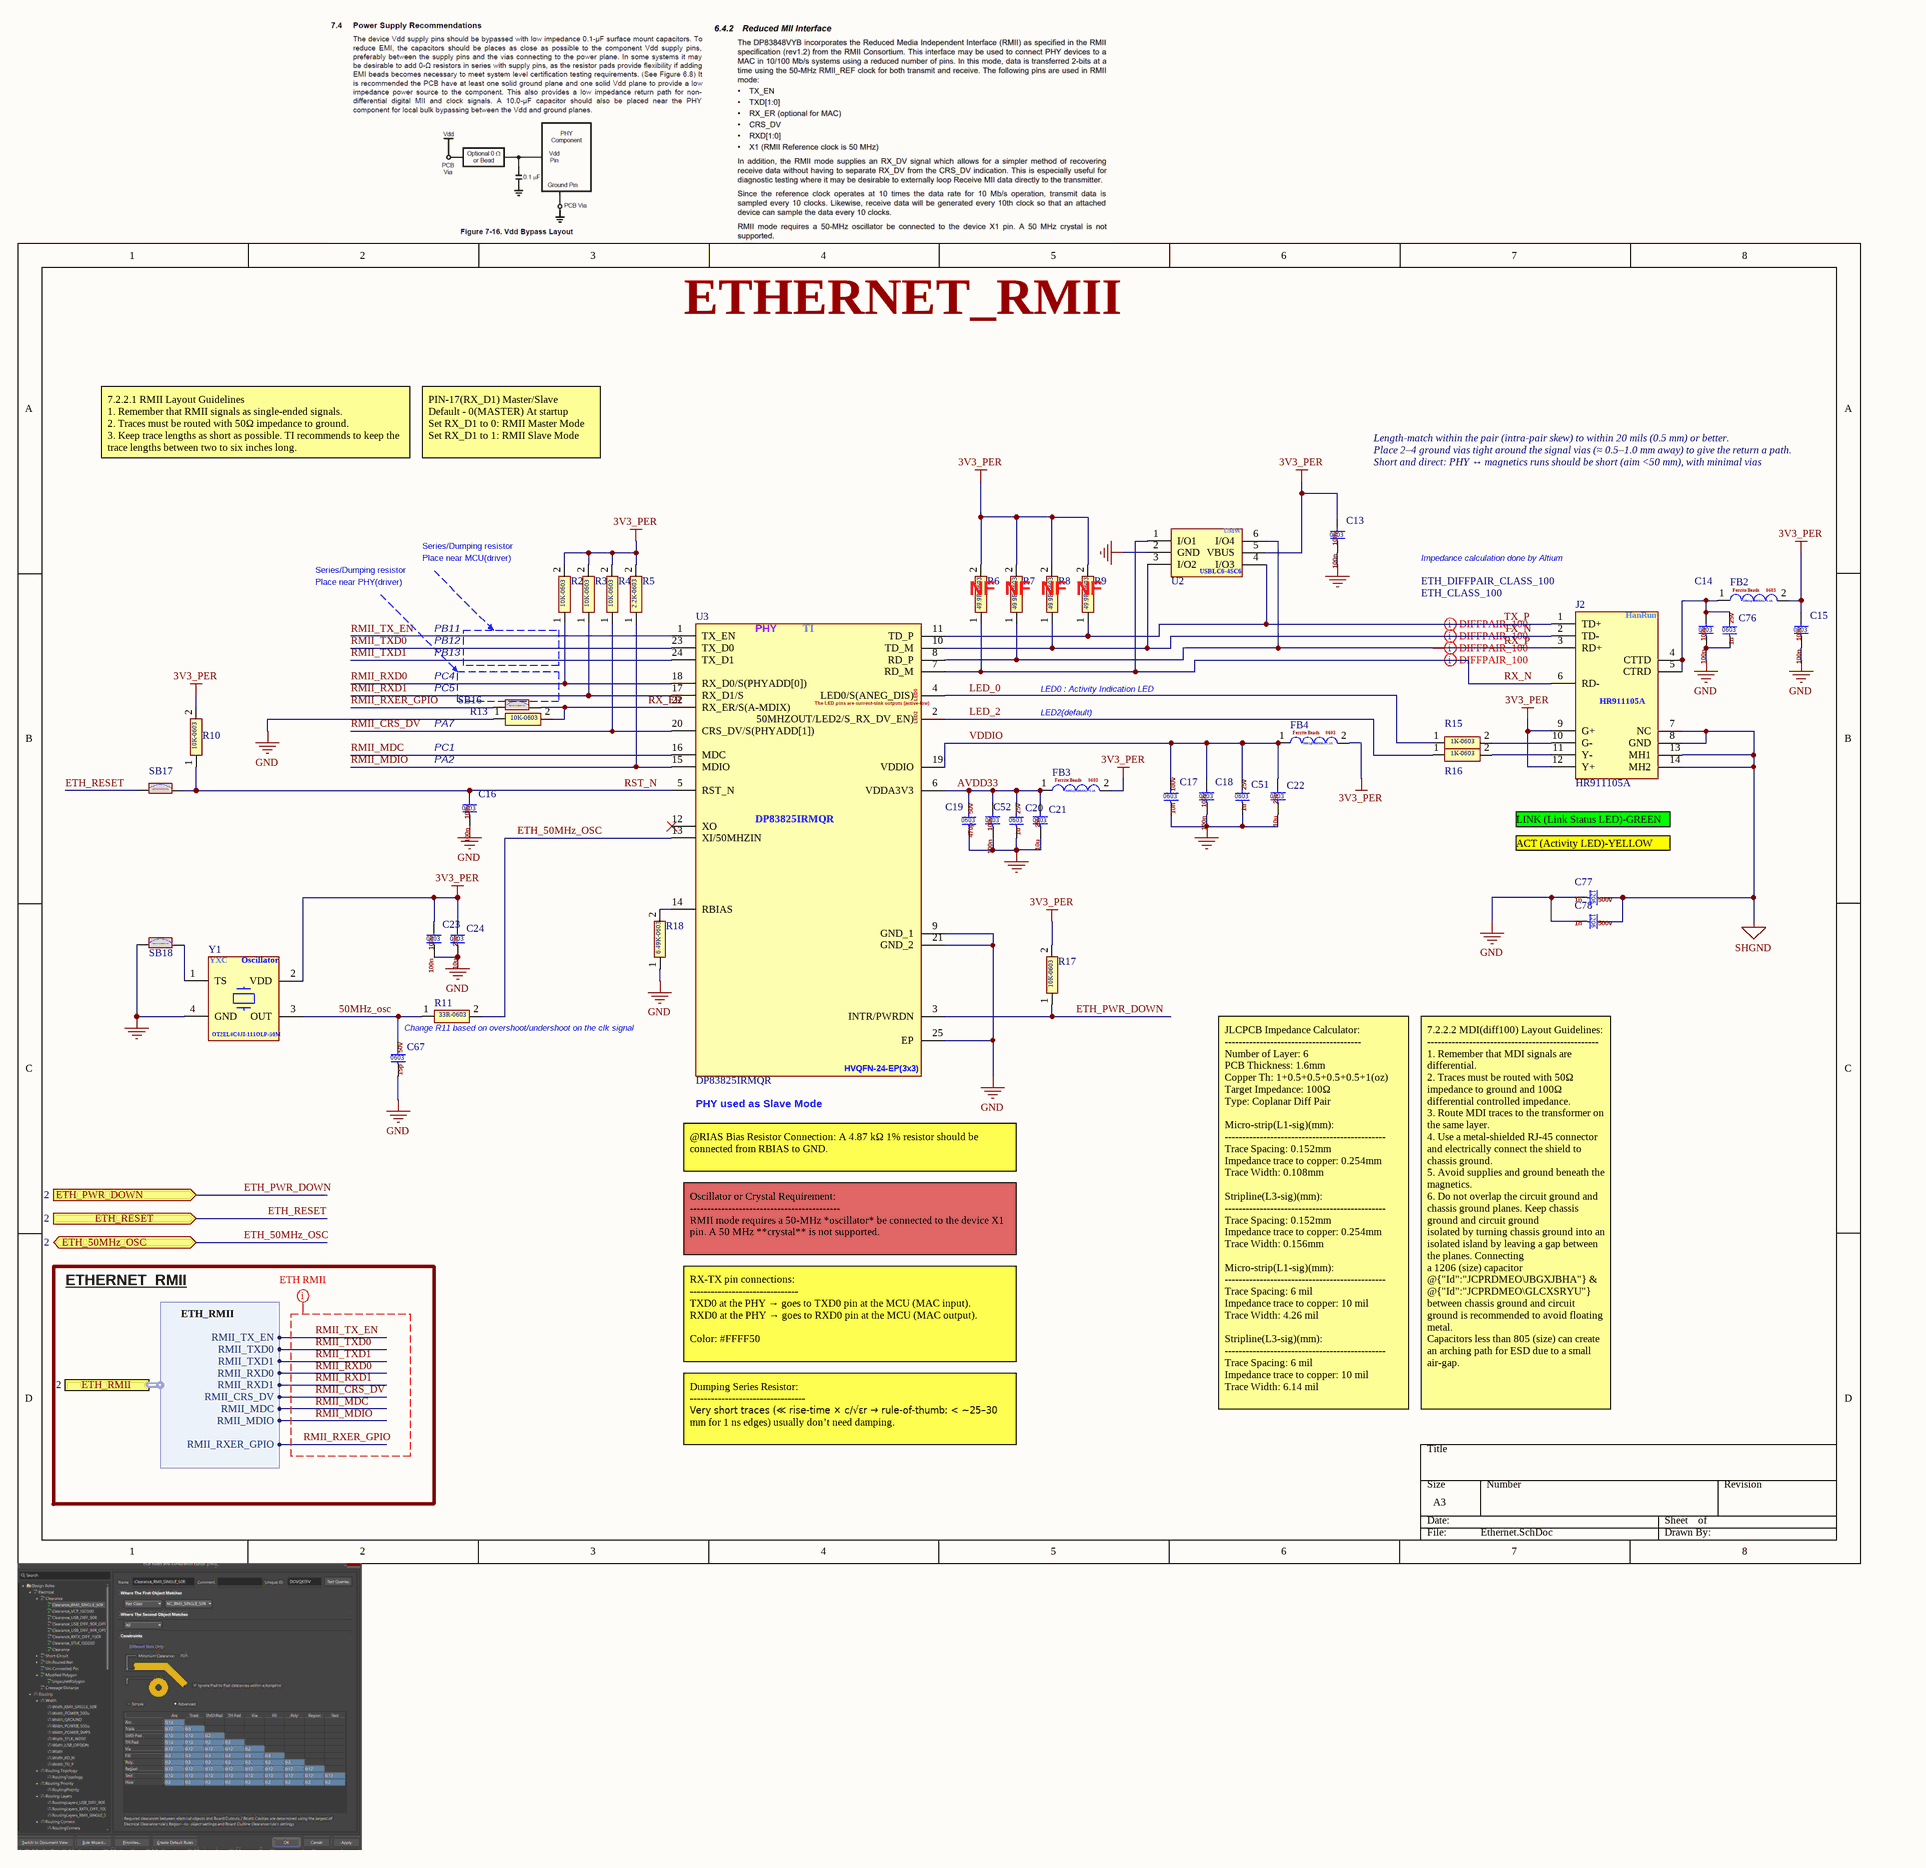
[diagram p4: Ethernet.SchDoc]

### Parts
C13  CL10B104KC8NNNC  [0603-CAP]  (value not drawn)
C14  CL10B104KC8NNNC  [0603-CAP]  (value not drawn)
C15  CL10B104KC8NNNC  [0603-CAP]  (value not drawn)
C16  CL10B104KC8NNNC  [0603-CAP]  (value not drawn)
C17  CL10B103KC8WPNC  [0603-CAP]  (value not drawn)
C18  CL10B104KC8NNNC  [0603-CAP]  (value not drawn)
C19  CL10B471KB8NNNC  [0603-CAP]  (value not drawn)
C20  CL10B105KA8NNNC  [0603-CAP]  (value not drawn)
C21  CL10A106MA8NRNC  [0603-CAP]  (value not drawn)
C22  CL10A106MA8NRNC  [0603-CAP]  (value not drawn)
C23  CL10B104KC8NNNC  [0603-CAP]  (value not drawn)
C24  CL10A106MA8NRNC  [0603-CAP]  (value not drawn)
C51  CL10B105KA8NNNC  [0603-CAP]  (value not drawn)
C52  CL10B104KC8NNNC  [0603-CAP]  (value not drawn)
C67  CL10C150JB8NNNC  [0603-CAP]  (value not drawn)
C76  CL10B105KA8NNNC  [0603-CAP]  (value not drawn)
C77  CL31B102KGFNNNE  [1206-CAP]  (value not drawn)
C78  CL31B102KGFNNNE  [1206-CAP]  (value not drawn)
FB2  BLM18KG601SN1D  [Ferrite Beads 0603]  (value not drawn)
FB3  BLM18KG601SN1D  [Ferrite Beads 0603]  (value not drawn)
FB4  BLM18KG601SN1D  [Ferrite Beads 0603]  (value not drawn)
J2  HR911105A  [HR911105A]
R2  0603WAF1002T5E  [0603-RES]  (value not drawn)
R3  0603WAF1002T5E  [0603-RES]  (value not drawn)
R4  0603WAF1002T5E  [0603-RES]  (value not drawn)
R5  0603WAF2201T5E  [0603-RES]  (value not drawn)
R6  0603WAF499JT5E  [0603-RES]  (value not drawn)
R7  0603WAF499JT5E  [0603-RES]  (value not drawn)
R8  0603WAF499JT5E  [0603-RES]  (value not drawn)
R9  0603WAF499JT5E  [0603-RES]  (value not drawn)
R10  0603WAF1002T5E  [0603-RES]  (value not drawn)
R11  0603WAF330JT5E  [0603-RES]  (value not drawn)
R13  0603WAF1002T5E  [0603-RES]  (value not drawn)
R15  0603WAF1001T5E  [0603-RES]  (value not drawn)
R16  0603WAF1001T5E  [0603-RES]  (value not drawn)
R17  0603WAF1002T5E  [0603-RES]  (value not drawn)
R18  0603WAF6491T5E  [0603-RES]  (value not drawn)
SB16  0603WAF0000T5E  [SOLDER-BRIDGE_R0603-0R]  (value not drawn)
SB17  0603WAF0000T5E  [SOLDER-BRIDGE_R0603-0R]  (value not drawn)
SB18  0603WAF0000T5E  [SOLDER-BRIDGE_R0603-0R]  (value not drawn)
U2  USBLC6-4SC6  [SOT-23-6]  (value not drawn)
U3  DP83825IRMQR  [HVQFN-24-EP(3x3)]
Y1  OT2EL4C4JI-111OLP-50M  [SMD3225-4P]  (value not drawn)

### Ports
ETH_50MHz_OSC (bidir, see 2), ETH_PWR_DOWN (in, see 2), ETH_RESET (in, see 2), ETH_RMII (harness ETH_RMII, see 2)

### Harnesses
ETH_RMII: RMII_TX_EN, RMII_TXD0, RMII_TXD1, RMII_RXD0, RMII_RXD1, RMII_CRS_DV, RMII_RXER_GPIO, RMII_MDC, RMII_MDIO

### Nets
3V3_PER: C13.2 C15.2 C23.2 C24.2 FB2.2 FB3.2 FB4.2 J2.9(G+) J2.12(Y+) R2.2 R3.2 R4.2 R5.2 R6.2 R7.2 R8.2 R9.2 R10.2 R17.2 U2.5(VBUS) Y1.2(VDD)  [project net 3V3_MCU]
GND: C13.1 C14.1 C15.1 C16.1 C17.1 C18.1 C19.1 C20.1 C21.1 C22.1 C23.1 C24.1 C51.1 C52.1 C67.1 C76.1 C77.1 C78.1 R13.1 R18.1 SB18.1 U2.2(GND) U3.9(GND_1) U3.21(GND_2) U3.25(EP) Y1.4(GND)
SHGND: C77.2 C78.2 J2.7(NC) J2.8(GND) J2.13(MH1) J2.14(MH2)
50MHz_osc: C67.2 R11.1 Y1.3(OUT)  [project net 50MHz_osc_4]
AVDD33: C19.2 C20.2 C21.2 C52.2 FB3.1 U3.6(VDDA3V3)  [project net AVDD33_4]
ETH_50MHz_OSC: R11.2 U3.13(XI/50MHZIN) ; port ETH_50MHz_OSC
ETH_PWR_DOWN: R17.1 U3.3(INTR/PWRDN) ; port ETH_PWR_DOWN
ETH_RESET: SB17.1 ; port ETH_RESET
LED_0: R15.1 U3.4(LED0/S(ANEG_DIS))  [project net LED_0_4]
LED_2: R16.1 U3.2(50MHZOUT/LED2/S_RX_DV_EN))  [project net LED_2_4]
RMII_CRS_DV: R4.1 U3.20(CRS_DV/S(PHYADD[1])) ; port ETH_RMII.RMII_CRS_DV
RMII_MDC: U3.16(MDC) ; port ETH_RMII.RMII_MDC
RMII_MDIO: R5.1 U3.15(MDIO) ; port ETH_RMII.RMII_MDIO
RMII_RXD0: R2.1 U3.18(RX_D0/S(PHYADD[0])) ; port ETH_RMII.RMII_RXD0
RMII_RXD1: R3.1 U3.17(RX_D1/S) ; port ETH_RMII.RMII_RXD1
RMII_RXER_GPIO: SB16.1 ; port ETH_RMII.RMII_RXER_GPIO
RMII_TX_EN: U3.1(TX_EN) ; port ETH_RMII.RMII_TX_EN
RMII_TXD0: U3.23(TX_D0) ; port ETH_RMII.RMII_TXD0
RMII_TXD1: U3.24(TX_D1) ; port ETH_RMII.RMII_TXD1
RST_N: C16.2 R10.1 SB17.2 U3.5(RST_N)  [project net RST_N_4]
RX_ER: R13.2 SB16.2 U3.22(RX_ER/S(A-MDIX))  [project net RX_ER_4]
RX_N: J2.6(RD-) R6.1 U2.1(I/O1) U3.7(RD_M)  [project net RX_N_4]
RX_P: J2.3(RD+) R7.1 U2.6(I/O4) U3.8(RD_P)  [project net RX_P_4]
TX_N: J2.2(TD-) R8.1 U2.3(I/O2) U3.10(TD_M)  [project net TX_N_4]
TX_P: J2.1(TD+) R9.1 U2.4(I/O3) U3.11(TD_P)  [project net TX_P_4]
VDDIO: C17.2 C18.2 C22.2 C51.2 FB4.1 U3.19(VDDIO)  [project net VDDIO_4]
NetC14_2: C14.2 C76.2 FB2.1 J2.4(CTTD) J2.5(CTRD)
NetJ2_10: J2.10(G-) R15.2
NetJ2_11: J2.11(Y-) R16.2
NetR18_2: R18.2 U3.14(RBIAS)
NetSB18_2: SB18.2 Y1.1(TS)

Not connected (* = marked no-connect by the designer): U3 12(XO)*

### Layout directives
differential pair; differential pair class ETH_DIFFPAIR_CLASS_100; net class ETH_CLASS_100: RX_N_4, RX_P_4, TX_N_4, TX_P_4
net class ETH_RMII_CLASS_50; rule Matched Net Lengths [Tolerance = 20mil]: RMII_CRS_DV, RMII_MDC, RMII_MDIO, RMII_RXD0, RMII_RXD1, RMII_RXER_GPIO, RMII_TX_EN, RMII_TXD0, RMII_TXD1

### Notes on the sheet
- ETHERNET_RMII
- 7.2.2.1 RMII Layout Guidelines
  1. Remember that RMII signals as single-ended signals.
  2. Traces must be routed with 50Ω impedance to ground.
  3. Keep trace lengths as short as possible. TI recommends to keep the trace lengths between two to six inches long.
- PIN-17(RX_D1) Master/Slave
  Default - 0(MASTER) At startup
  Set RX_D1 to 0: RMII Master Mode
  Set RX_D1 to 1: RMII Slave Mode
- Length-match within the pair (intra-pair skew) to within 20 mils (0.5 mm) or better.
- Place 2–4 ground vias tight around the signal vias (≈ 0.5–1.0 mm away) to give the return a path.
- Short and direct: PHY ↔ magnetics runs should be short (aim <50 mm), with minimal vias
- Series/Dumping resistor
- Place near MCU(driver)
- Impedance calculation done by Altium
- Place near PHY(driver)
- PB11
- (near R6) NF
- (near R7) NF
- (near R8) NF
- (near R9) NF
- PB12
- PB13
- PC4
- PC5
- LED0 : Activity Indication LED
- PA7
- PC1
- (near U3) Pull-down: Disable Auto-MDIX
- LED2(default)
- (near C16) PA2
- LINK (Link Status LED)-GREEN
- ACT (Activity LED)-YELLOW
- (near R11) Change R11 based on overshoot/undershoot on the clk signal
- PHY used as Slave Mode
- @RIAS Bias Resistor Connection: A 4.87 kΩ 1% resistor should be connected from RBIAS to GND.
- Oscillator or Crystal Requirement:
  -------------------------------------------
  RMII mode requires a 50-MHz *oscillator* be connected to the device X1 pin. A 50 MHz **crystal** is not supported.
- RX-TX pin connections:
  -------------------------------
  TXD0 at the PHY → goes to TXD0 pin at the MCU (MAC input).
  RXD0 at the PHY → goes to RXD0 pin at the MCU (MAC output).
  Color: #FFFF50
- JLCPCB Impedance Calculator:
  ---------------------------------------
  Number of Layer: 6
  PCB Thickness: 1.6mm
  Copper Th: 1+0.5+0.5+0.5+0.5+1(oz)
  Target Impedance: 100Ω
  Type: Coplanar Diff Pair
  Micro-strip(L1-sig)(mm):
  ----------------------------------------------
  Trace Spacing: 0.152mm
  Impedance trace to copper: 0.254mm
  Trace Width: 0.108mm
  Stripline(L3-sig)(mm):
  ----------------------------------------------
  Trace Spacing: 0.152mm
  Impedance trace to copper: 0.254mm
  Trace Width: 0.156mm
  Micro-strip(L1-sig)(mm):
  ----------------------------------------------
  Trace Spacing: 6 mil
  Impedance trace to copper: 10 mil
  Trace Width: 4.26 mil
  Stripline(L3-sig)(mm):
  ----------------------------------------------
  Trace Spacing: 6 mil
  Impedance trace to copper: 10 mil
  Trace Width: 6.14 mil
- 7.2.2.2 MDI(diff100) Layout Guidelines:
  -------------------------------------------------
  1. Remember that MDI signals are differential.
  2. Traces must be routed with 50Ω impedance to ground and 100Ω differential controlled impedance.
  3. Route MDI traces to the transformer on the same layer.
  4. Use a metal-shielded RJ-45 connector and electrically connect the shield to chassis ground.
  5. Avoid supplies and ground beneath the magnetics.
  6. Do not overlap the circuit ground and chassis ground planes. Keep chassis ground and circuit ground
  isolated by turning chassis ground into an isolated island by leaving a gap between the planes. Connecting
  a 1206 (size) capacitor @{"Id":"JCPRDMEO\JBGXJBHA"} & @{"Id":"JCPRDMEO\GLCXSRYU"} between chassis ground and circuit ground is recommended to avoid floating metal.
  Capacitors less than 805 (size) can create an arching path for ESD due to a small air-gap.
- Dumping Series Resistor:
  ---------------------------------
  Very short traces (≪ rise-time × c/√εr → rule-of-thumb: < ~25–30 mm for 1 ns edges) usually don’t need damping.
- Title:
- Project:
- Size:
- Revision:
- Variant:
- A4
- -
- Date:
- Reference:
- Sheet:
- of
- (in symbol 0603WAF330JT5E) 33R-0603
- (in symbol 0603WAF499JT5E) 49.9R-0603
- (in symbol 0603WAF1001T5E) 1K-0603
- (in symbol 0603WAF1002T5E) 10K-0603
- (in symbol 0603WAF2201T5E) 2.2K-0603
- (in symbol 0603WAF6491T5E) 6.49K-0603
- (in symbol BLM18KG601SN1D) Ferrite Beads; 0603; 600Ω@100MHz, 1.3A
- (in symbol CL10A106MA8NRNC) 25v; 0603; 10u
- (in symbol CL10B103KC8WPNC) 100v; 0603; 10n
- (in symbol CL10B104KC8NNNC) 100v; 0603; 100n
- (in symbol CL10B105KA8NNNC) 25v; 0603; 1u
- (in symbol CL10B471KB8NNNC) 50v; 0603; 470p
- (in symbol CL10C150JB8NNNC) 50v; 0603; 15p
- (in symbol CL31B102KGFNNNE) 1206; 1n; 500v
- (in symbol DP83825IRMQR) PHY; TI; LED0; The LED pins are current-sink outputs (active-low); LED2; HVQFN-24-EP(3x3)
- (in symbol HR911105A) HanRun
- (in symbol OT2EL4C4JI-111OLP-50M) YXC; Oscillator
- (in symbol USBLC6-4SC6) UMW

### Library data of the parts
C13-C16 C18 C23 C52 = CL10B104KC8NNNC: as C3 on sheet MCU; LCSC Part #: C15725; Unit Price: 0.0036; ComponentLink1Description: DS; ComponentLink1URL: https://www.lcsc.com/datasheet/C15725.pdf
C17 = CL10B103KC8WPNC: CAP: CER 10NF 100V X7R 0603; LCSC Part #: C307347; Unit Price: 0.0046
C19 = CL10B471KB8NNNC: CAP: CER 470PF 50V X7R 0603; POC Price: 0.0047; LCSC Part #: C22396; Unit Price: 0.002; ComponentLink1Description: DS; ComponentLink1URL: https://www.lcsc.com/datasheet/C22396.pdf
C20 C51 C76 = CL10B105KA8NNNC: CAP: CER 1UF 25V X7R 0603; LCSC Part #: C29936; Unit Price: 0.0027; ComponentLink1Description: DS; ComponentLink1URL: https://www.lcsc.com/datasheet/C29936.pdf
C21 C22 C24 = CL10A106MA8NRNC: CAP: CER 10UF 25V X5R 0603; LCSC Part #: C96446; Unit Price: 0.01; ComponentLink1Description: DS; ComponentLink1URL: https://www.lcsc.com/datasheet/C96446.pdf
C67 = CL10C150JB8NNNC: CAP: CER 15PF 50V C0G 0603; POC Price: 0.0051; LCSC Part #: C1644; Unit Price: 0.0032; ComponentLink1Description: DS; ComponentLink1URL: https://www.lcsc.com/datasheet/C1644.pdf
C77 C78 = CL31B102KGFNNNE: CAP: SAFETY CER 1NF 500V X7R 1206; POC Price: 0.04; LCSC Part #: C35216; Unit Price: 0.0223; ComponentLink1Description: DS; ComponentLink1URL: https://www.lcsc.com/datasheet/C35216.pdf
FB2-FB4 = BLM18KG601SN1D: Ferrite Beads: 150mΩ 600Ω@100MHz 1.3A muRata; POC Price: 0.0113; LCSC Part #: C85833; Unit Price: 0.0059; ComponentLink1Description: DS; ComponentLink1URL: https://www.lcsc.com/datasheet/C85833.pdf
J2 = HR911105A: RJ45: ETH RJ45 Jack 1 With LED Through Hole Ethernet Connectors / Modular Connectors (RJ45 RJ11) ROHS; POC Price: 1.4848; LCSC Part #: C12074; Unit Price: 0.8599; ComponentLink1Description: DS; ComponentLink1URL: https://datasheet.lcsc.com/szlcsc/Zhongshan-HanRun-Elec-HR911105A_C12074.pdf
R2-R4 R10 R13 R17 = 0603WAF1002T5E: RES: 10K OHM 1% 100mW 0603 75V; LCSC Part #: C25804; Unit Price: 0.0005; ComponentLink1Description: DS; ComponentLink1URL: https://www.lcsc.com/datasheet/C25804.pdf
R5 = 0603WAF2201T5E: RES: 2.2K OHM 1% 100mW 0603 75V; POC Price: 0.0011; LCSC Part #: C4190; Unit Price: 0.0005; ComponentLink1Description: DS; ComponentLink1URL: https://www.lcsc.com/datasheet/C4184.pdf
R6-R9 = 0603WAF499JT5E: RES: 49.9 OHM 1% 100mW 0603; LCSC Part #: C23185; Unit Price: 0.0006; ComponentLink1Description: DS; ComponentLink1URL: https://www.lcsc.com/datasheet/C23185.pdf
R11 = 0603WAF330JT5E: RES: 33 OHM 1% 100mW 0603 75V; POC Price: 0.0011; LCSC Part #: C23140; Unit Price: 0.0006; ComponentLink1Description: DS; ComponentLink1URL: https://www.lcsc.com/datasheet/C4216.pdf
R15 R16 = 0603WAF1001T5E: RES: 1K OHM 1% 100mW 0603 75V; LCSC Part #: C21190; Unit Price: 0.0005; ComponentLink1Description: DS; ComponentLink1URL: https://www.lcsc.com/datasheet/C21190.pdf
R18 = 0603WAF6491T5E: RES: 6.49K OHM 1% 100mW 0603 75V; POC Price: 0.0011; LCSC Part #: C23088; Unit Price: 0.0006; ComponentLink1Description: DS; ComponentLink1URL: https://www.lcsc.com/datasheet/C23088.pdf
SB16-SB18 = 0603WAF0000T5E: Solder Bridge: ON SB 0603; LCSC Part #: C21189; Unit Price: 0.0006; ComponentLink1Description: DS; ComponentLink1URL: https://www.lcsc.com/datasheet/C21189.pdf
U2 = USBLC6-4SC6: ESD: 3.5A@8/20us 13V 60W@8/20us 7.8V 5V SOT-23-6 ESD and Surge Protection (TVS/ESD) ROHS; POC Price: 0.0286; LCSC Part #: C19626383; Unit Price: 0.0133; ComponentLink1Description: DS; ComponentLink1URL: https://www.lcsc.com/datasheet/C19626383.pdf
U3 = DP83825IRMQR: PHY: Ethernet Transceiver RMII HVQFN-24-EP(3x3) Ethernet Transceivers ROHS; POC Price: 0.2675; LCSC Part #: C783599; ComponentLink1Description: DS; ComponentLink1URL: https://www.ti.com/lit/ds/symlink/dp83825i.pdf?ts=1756962275334&ref_url=https%253A%252F%252Fwww.ti.com%252Fproduct%252FDP83825I%252Fpart-details%252FDP83825IRMQR; Unit Price: 0.1317
Y1 = OT2EL4C4JI-111OLP-50M: Crystal: 1.8V~3.3V ±10ppm ±20ppm CMOS 50MHz SMD3225-4P Crystal Oscillators ROHS; POC Price: 0.4204; LCSC Part #: C5203552; Unit Price: 0.2026; ComponentLink2Description: DS; ComponentLink2URL: https://www.lcsc.com/datasheet/C5203552.pdf